# EasyEDA Pro project ProPrj_Segun O pcb_2026-03-03.epro, board KCP-2282-601-PCBV3.8
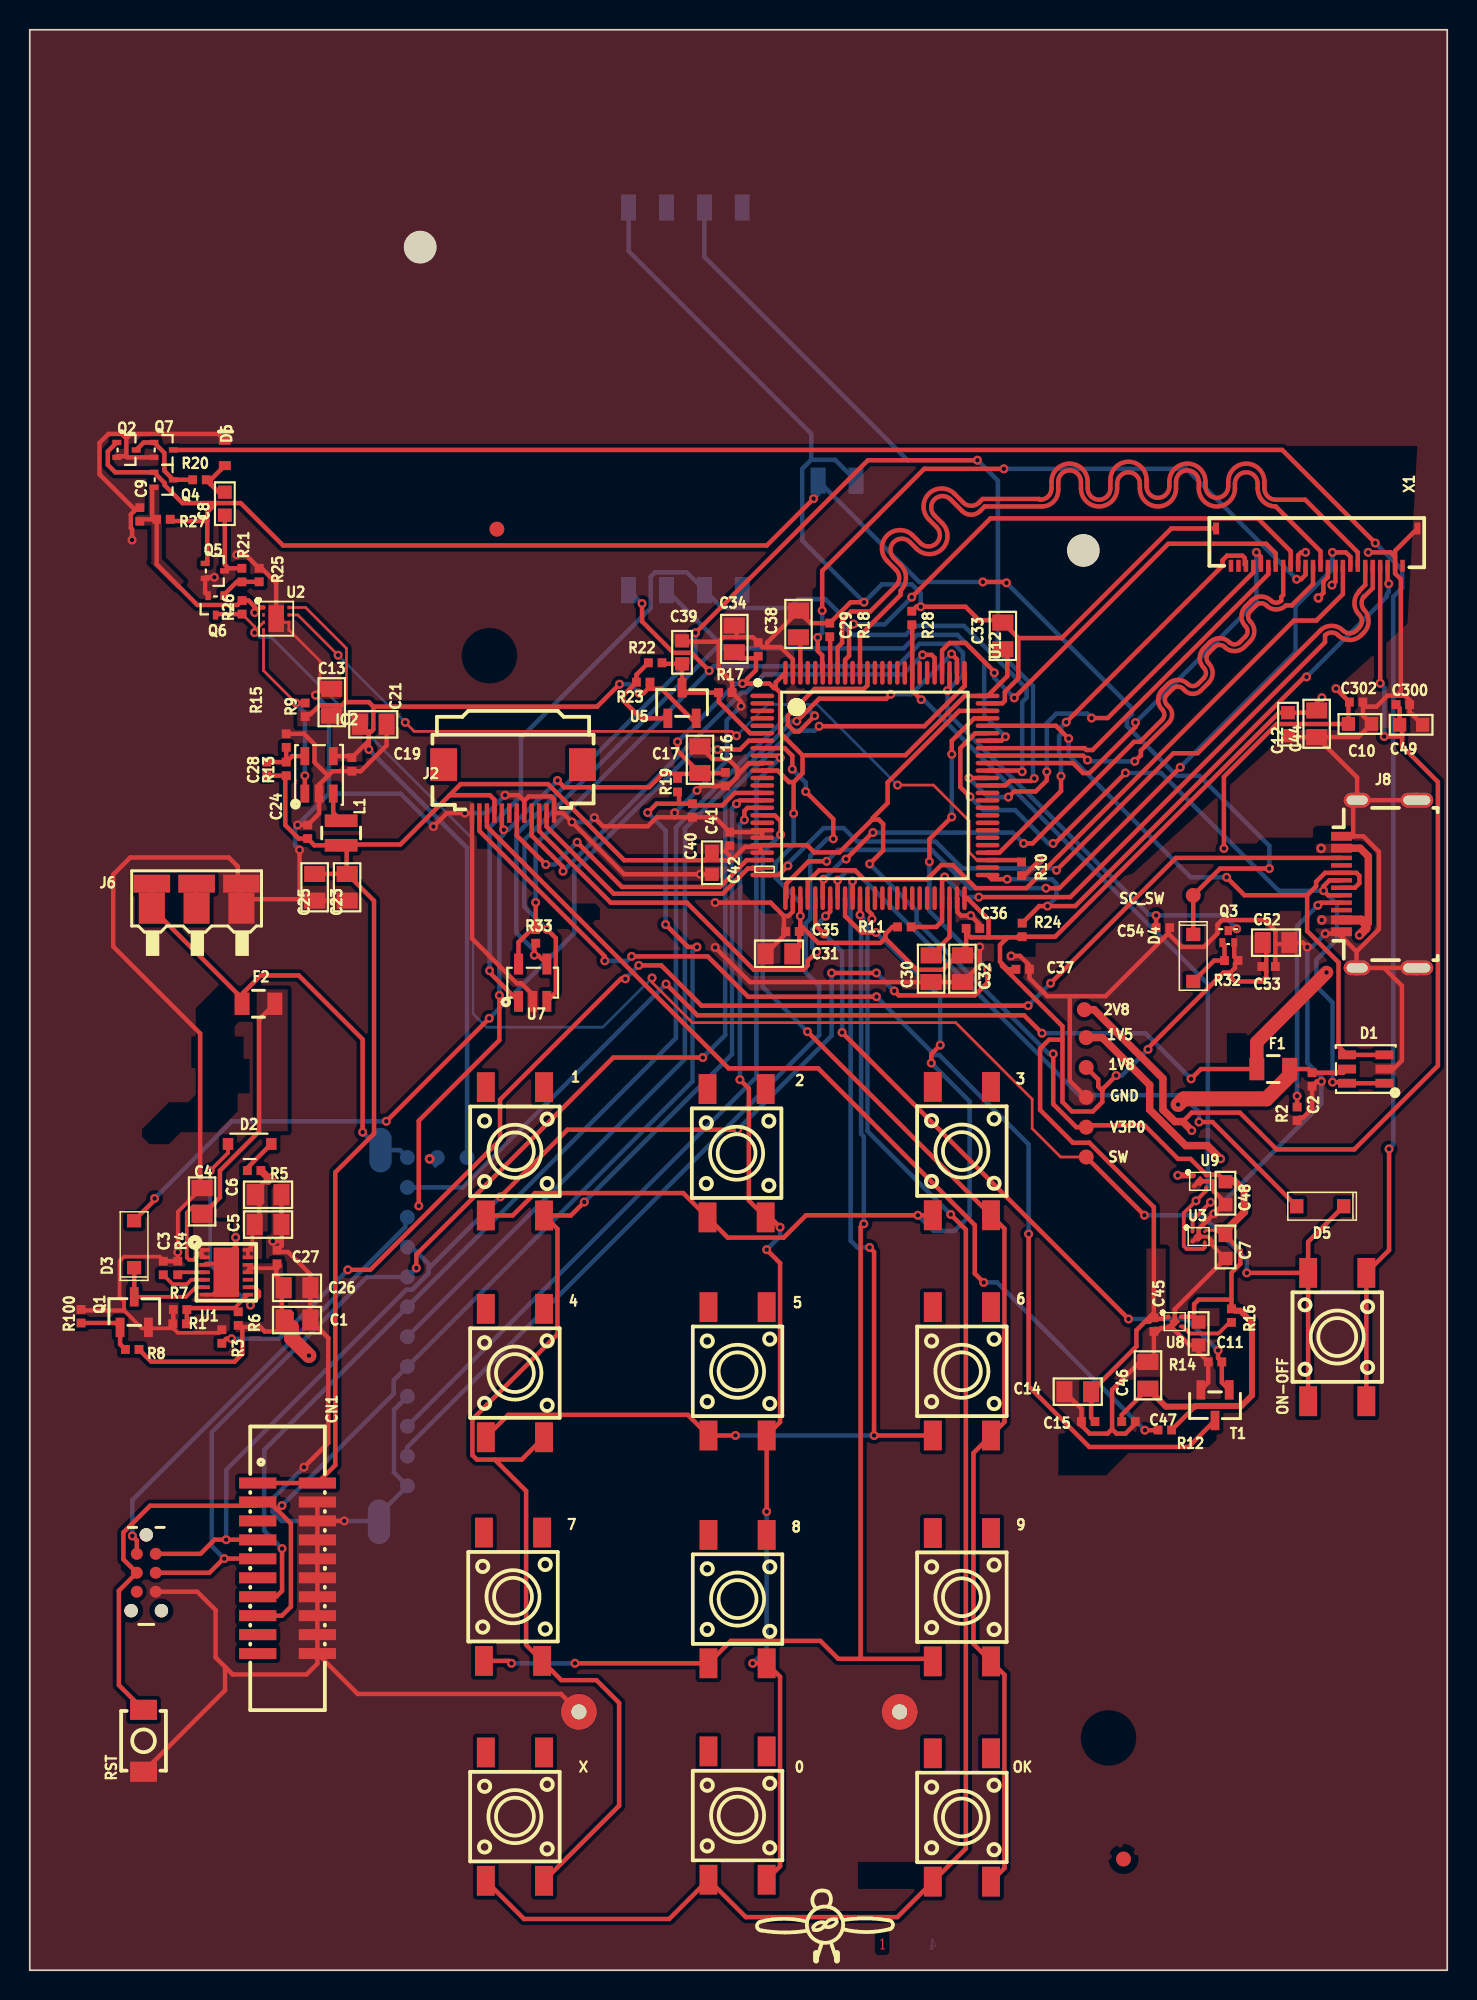
[diagram p4: board, top side]
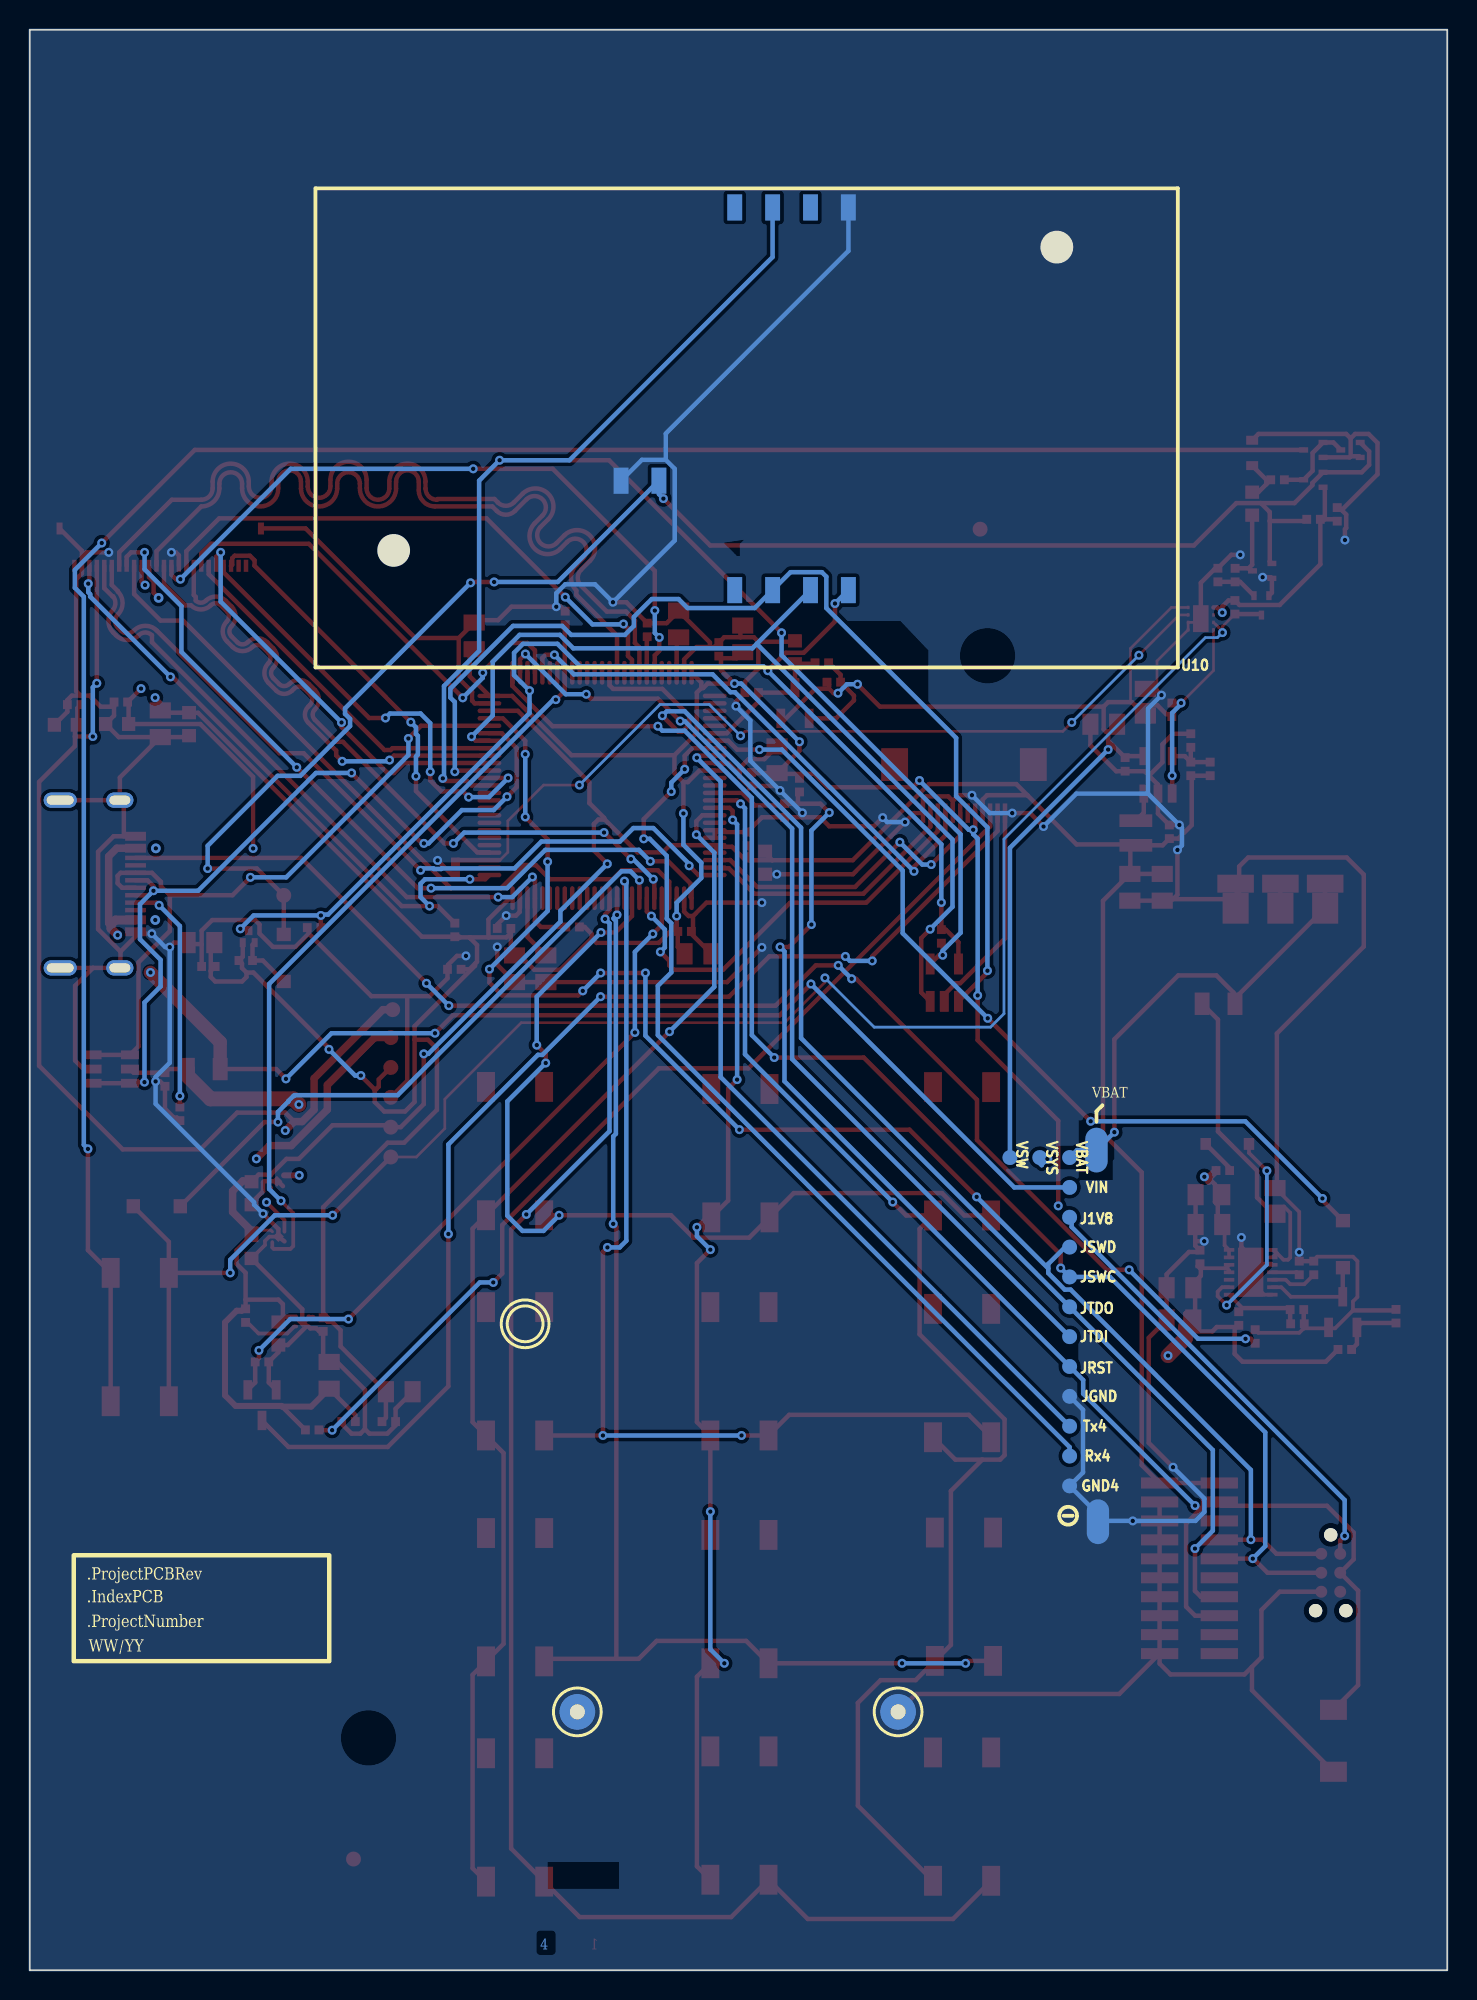
[diagram p5: board, bottom side, seen from below]

Outline 95 x 130 mm; copper layers: Top Layer, GND (2), VCC (3), Bottom Layer. Coordinates in mm from the lower left corner of the outline.
Outline path: 0,130 0,0 95,0 95,130 0,130
Stack: Top Layer 0.035mm / Dielectric1 0.127mm 2116 er 4.2 / GND (2) 0.035mm / Dielectric2 1.2mm FR-4 er 4.2 / VCC (3) 0.0356mm / Dielectric4 0.127mm 2116 er 4.2 / Bottom Layer 0.035mm

## Design rules (mm)
net CAM_D5: DP7
net CAM_PCLK: DP2
net CAM_XCLK: DP2
net CAM_D0: DP8
net CAM_D1: DP8
net CAM_D7: DP6
net CAM_RST: DP4
net CAM_D4: DP7
net CAM_VS: DP6
net CAM_SCL: DP4
template: User Custom Config
spacing Clearance_DEGRAP_1: track to track 0.152, other pairs 0.152 to 0.3
spacing BoardOutlineClearance_Overlay: track to track 0.125, other pairs 0.125 to 0.3
spacing BoardOutlineClearance_DEGRAPP: track to track 0.125, other pairs 0.125 to 0.3
spacing BoardOutlineClearance_HOLE_BLE_ANT: track to track 0.125, other pairs 0.125 to 0.3
spacing Clearance_RF: track to track 0.185, other pairs 0.185 to 0.3
spacing Clearance: track to track 0.125, other pairs 0.125 to 0.3
spacing Clearance_DEGRAP: track to track 0.5, other pairs 0.3 to 0.5
spacing BoardOutlineClearance: track to track 0.125, other pairs 0.125 to 0.3
spacing safeClearance (default): track to track 0.125, other pairs 0.125 to 0.3
track width Width (default): min 0.15, default 0.3, max 5
differential pair DiffPairsRouting (default): width min 0.15, default 0.15, max 0.15; gap min 0.15, default 0.15
differential pair DiffPairsRouting_100: width min 0.15, default 0.15, max 0.15; gap min 0.2, default 0.2
via RoutingVias (default): diameter min 0.25, default 0.6, max 10; hole min 0.1, default 0.3, max 8
net BLE_OUT uses Clearance_RF
net BLE_RF uses Clearance_RF
net BLE_ANT uses Clearance_RF

## Placement (name value [footprint] x y rotation side)
0  TS-1095PS-A1B2-C3D2  [KEY-SMD_4P-L6.0-W6.0-P3.90-LS9.0]  47.44 10.36 270 top
1  TS-1095PS-A1B2-C3D2  [KEY-SMD_4P-L6.0-W6.0-P3.90-LS9.0]  32.51 54.86 270 top
1V5  TP  [TESTPOINT 1MM]  70.81 62.48 180 top
1V8  TP  [TESTPOINT 1MM]  70.81 60.48 180 top
2  TS-1095PS-A1B2-C3D2  [KEY-SMD_4P-L6.0-W6.0-P3.90-LS9.0]  47.37 54.74 270 top
2V8  TP  [TESTPOINT 1MM]  70.68 64.35 180 top
3  TS-1095PS-A1B2-C3D2  [KEY-SMD_4P-L6.0-W6.0-P3.90-LS9.0]  62.47 54.88 270 top
4  TS-1095PS-A1B2-C3D2  [KEY-SMD_4P-L6.0-W6.0-P3.90-LS9.0]  32.51 40 270 top
5  TS-1095PS-A1B2-C3D2  [KEY-SMD_4P-L6.0-W6.0-P3.90-LS9.0]  47.44 40.12 270 top
6  TS-1095PS-A1B2-C3D2  [KEY-SMD_4P-L6.0-W6.0-P3.90-LS9.0]  62.47 40.12 270 top
7  TS-1095PS-A1B2-C3D2  [KEY-SMD_4P-L6.0-W6.0-P3.90-LS9.0]  32.39 25.02 270 top
8  TS-1095PS-A1B2-C3D2  [KEY-SMD_4P-L6.0-W6.0-P3.90-LS9.0]  47.44 24.86 270 top
9  TS-1095PS-A1B2-C3D2  [KEY-SMD_4P-L6.0-W6.0-P3.90-LS9.0]  62.47 24.99 270 top
B  TP  [PLAGE - ROUGE]  23.51 54.94 90 bottom
C1  4.7uF  [0805 - CAPACITOR]  17.91 43.56 0 top
C2  100nF  [0402 - CAPACITOR]  85.94 59.67 270 top
C3  4.7uF  [0402 - CAPACITOR]  8.94 47.05 270 top
C4  4.7uF  [0805 - CAPACITOR]  11.54 51.5 90 top
C5  4.7uF  [0805 - CAPACITOR]  15.97 49.96 0 top
C6  4.7uF  [0805 - CAPACITOR]  15.97 51.96 0 top
C7  1uF  [0603 - CAPACITOR]  80.14 48.45 270 top
C8  1uF  [0603 - CAPACITOR]  13.07 98.25 270 top
C9  100nF  [0402 - CAPACITOR]  7.37 97.54 90 top
C10  1uF  [0603 - CAPACITOR]  89.15 83.49 0 top
C11  1uF  [0603 - CAPACITOR]  78.34 42.65 270 top
C12  1uF  [0603 - CAPACITOR]  84.33 83.48 270 top
C13  4.7uF  [0805 - CAPACITOR]  20.23 84.95 90 top
C14  4.7uF  [0805 - CAPACITOR]  70.24 38.75 180 top
C15  100nF  [0402 - CAPACITOR]  70.94 36.75 180 top
C16  100nF  [0402 - CAPACITOR]  46.62 79.79 270 top
C17  4.7uF  [0805 - CAPACITOR]  44.91 81.09 90 top
C19  100nF  [0402 - CAPACITOR]  21.58 80.78 270 top
C21  4.7uF  [0805 - CAPACITOR]  23.02 83.48 0 top
C23  4.7uF  [0805 - CAPACITOR]  21.27 72.55 270 top
C24  100nF  [0402 - CAPACITOR]  18.62 76.27 90 top
C25  4.7uF  [0805 - CAPACITOR]  19.1 72.55 270 top
C26  4.7uF  [0805 - CAPACITOR]  17.91 45.72 0 top
C27  100nF  [0402 - CAPACITOR]  16.57 47.78 90 top
C28  9pF  [0402 - CAPACITOR]  15.88 80.48 270 top
C29  2.2uF  [0805 - CAPACITOR]  51.52 90.19 90 top
C30  2.2uF  [0805 - CAPACITOR]  60.41 67.09 270 top
C31  4.7uF  [0805 - CAPACITOR]  50.22 68.09 180 top
C32  4.7uF  [0805 - CAPACITOR]  62.52 67.09 270 top
C33  4.7uF  [0805 - CAPACITOR]  65.22 89.39 90 top
C34  4.7uF  [0805 - CAPACITOR]  47.22 89.19 90 top
C35  100nF  [0402 - CAPACITOR]  51.12 69.59 180 top
C36  100nF  [0402 - CAPACITOR]  63.22 69.79 0 top
C37  100nF  [0402 - CAPACITOR]  66.55 67.06 0 top
C38  100nF  [0402 - CAPACITOR]  48.81 88.49 90 top
C39  1uF  [0603 - CAPACITOR]  43.72 88.29 90 top
C40  100nF  [0402 - CAPACITOR]  44.41 77.69 270 top
C41  1uF  [0603 - CAPACITOR]  45.72 74.19 270 top
C42  100nF  [0402 - CAPACITOR]  46.91 75.79 90 top
C44  4.7uF  [0805 - CAPACITOR]  86.26 83.51 270 top
C45  100nF  [0402 - CAPACITOR]  75.34 43.25 270 top
C46  4.7uF  [0805 - CAPACITOR]  74.94 39.85 90 top
C47  100nF  [0402 - CAPACITOR]  73.64 36.75 0 top
C48  1uF  [0603 - CAPACITOR]  80.14 52.05 270 top
C49  0603X105K500CT  [0603 - CAPACITOR]  92.59 83.44 0 top
C52  4.7uF  [0805 - CAPACITOR]  83.53 68.85 0 top
C53  100nF  [0402 - CAPACITOR]  83.03 67.25 0 top
C54  100nF  [0402 - CAPACITOR]  75.95 69.85 0 top
C300  100nF  [0402 - CAPACITOR]  92.03 84.79 0 top
C302  0402B104K500CT  [0402 - CAPACITOR]  88.9 84.96 0 top
CN1  HX JN1.27-2x10 TP H4.9  [CONN-SMD_HX-JN1.27-2X10-TP-H4.9]  17.27 26.92 270 top
D1  82400152  [SOT23-6 0.95 VAR AA]  89.54 60.37 90 top
D2  LR_Y8SF-U1V2-1  [OSRAM LRY8SFU1V21]  14.73 55.24 270 top
D3  MBR0530  [SOD123 DIODE INC]  6.99 48.64 270 top
D4  MBR0530T1G  [SOD123 DIODE INC]  77.98 67.82 90 top
D5  MBR0530T1G  [SOD123 DIODE INC]  86.49 51.18 0 top
D6  BZX585-C3V0,115  [SOD523 TOSHIBA]  13.07 101.65 270 top
F1  BNP05000F000  [0805 - FUSE]  83.34 60.37 0 top
F2  0ZCK0075FF2E  [0805 - FUSE]  15.32 64.75 0 top
GND  TP  [TESTPOINT 1MM]  70.81 58.48 180 top
GND4  TP  [TESTPOINT 1MM]  25.31 32.44 270 bottom
IC2  SY8088IAAC  [SOT23-5 0.95 VAR AA]  19.38 80.08 0 top
J1V8  TP  [TESTPOINT 1MM]  25.31 50.44 270 bottom
J2  FFC2B35-12-G  [GCT FFC2B35-12-G]  32.39 80.77 180 top
J6  1982633-1  [TE 19826331]  11.18 71.75 180 top
J8  U6252-35c  [ANTENK U6252-35C]  92.97 72.77 270 top
JGND  TP  [TESTPOINT 1MM]  25.31 38.44 270 bottom
JRST  TP  [TESTPOINT 1MM]  25.31 40.44 270 bottom
JSWC  TP  [TESTPOINT 1MM]  25.31 46.44 270 bottom
JSWD  TP  [TESTPOINT 1MM]  25.31 48.44 270 bottom
JTDI  TP  [TESTPOINT 1MM]  25.31 42.44 270 bottom
JTDO  TP  [TESTPOINT 1MM]  25.31 44.44 270 bottom
L1  2.2uH  [CHILISON BWF00252012]  20.87 76.19 270 top
M  TP  [PLAGE - NOIRE]  23.41 30.04 270 bottom
Mire Top 1  DNI  [MIRE]  73.31 7.44 90 top
Mire Top 2  DNI  [MIRE]  31.31 96.54 90 top
NOREF  -  [Pad_ie1681]  30.81 88.06 0 top
NOREF#2  -  [Pad_ie1682]  72.3 15.56 0 top
NOREF#3  -  [Pad_ie1678]  58.3 17.3 0 top
NOREF#4  -  [Pad_ie1679]  36.8 17.3 0 top
OK  TS-1095PS-A1B2-C3D2  [KEY-SMD_4P-L6.0-W6.0-P3.90-LS9.0]  62.47 10.23 270 top
ON-OFF  TS-1095PS-A1B2-C3D2  [KEY-SMD_4P-L6.0-W6.0-P3.90-LS9.0]  87.63 42.42 90 top
P210  -  [TC2030-MCP-NL]  7.8 29.16 270 top
Q1  BSS123-TP  [SOT23-VAR AB]  7 44.09 0 top
Q2  RE1C001UNTCL  [SOT-416-3]  6.48 101.85 270 top
Q3  RZM002P02T2L  [SOT-723]  80.33 69.25 0 top
Q4  RE1C001ZPTL  [SOT-416-3]  8.97 99.85 270 top
Q5  RE1C001UNTCL  [SOT-416-3]  12.4 93.75 270 top
Q6  RE1C001ZPTL  [SOT-416-3]  12.45 91.44 180 top
Q7  RE1C001ZPTL  [SOT-416-3]  8.97 101.85 270 top
R1  ERTJ0EP473GM  [0402 - RESISTOR]  10.03 43.31 0 top
R2  5.1kΩ  [0402 - RESISTOR]  84.94 57.37 90 top
R3  5.1kΩ  [0402 - RESISTOR]  12.87 42.46 270 top
R4  5.1kΩ  [0402 - RESISTOR]  9.92 47.05 90 top
R5  200Ω  [0402 - RESISTOR]  15.03 53.57 180 top
R6  40.2kΩ  [0402 - RESISTOR]  13.97 43.66 270 top
R7  118kΩ  [0402 - RESISTOR]  10.07 44.26 0 top
R8  10kΩ  [0402 - RESISTOR]  6.86 41.59 0 top
R9  100kΩ  [0402 - RESISTOR]  18.45 84.44 90 top
R10  100kΩ  [0402 - RESISTOR]  66.47 73.79 90 top
R11  10kΩ  [0402 - RESISTOR]  58.62 69.89 180 top
R12  RC0402FR-0710RL  [0402 - RESISTOR]  76.07 36.19 0 top
R13  205kΩ  [0402 - RESISTOR]  17.18 80.48 90 top
R14  100kΩ  [0402 - RESISTOR]  79.44 40.75 0 top
R15  49.9kΩ  [0402 - RESISTOR]  17.18 82.38 270 top
R16  100kΩ  [0402 - RESISTOR]  80.54 43.85 270 top
R17  10kΩ  [0402 - RESISTOR]  46.62 85.59 180 top
R18  10kΩ  [0402 - RESISTOR]  53.62 89.79 270 top
R19  10kΩ  [0402 - RESISTOR]  43.41 79.39 90 top
R20  10kΩ  [0402 - RESISTOR]  11.37 99.85 0 top
R21  220kΩ  [0402 - RESISTOR]  14.21 93.47 90 top
R22  220kΩ  [0402 - RESISTOR]  41.91 87.59 180 top
R23  75kΩ  [0402 - RESISTOR]  41.12 86.29 0 top
R24  10kΩ  [0402 - RESISTOR]  66.52 69.69 270 top
R25  220kΩ  [0402 - RESISTOR]  15.37 93.47 270 top
R26  750kΩ  [0402 - RESISTOR]  14.23 91.31 90 top
R27  1MΩ  [0402 - RESISTOR]  8.95 97.21 180 top
R28  100kΩ  [0402 - RESISTOR]  59.12 90.59 270 top
R32  220kΩ  [0402 - RESISTOR]  80.53 67.65 180 top
R33  11.5kΩ  [0402 - RESISTOR]  33.9 69.26 90 top
R100  220kΩ  [0402 - RESISTOR]  3.43 43.81 270 top
RST  TS-1071AS-A1B3-D4  [SW-SMD_L4.0-W3.0-LS4.8]  7.62 15.37 90 top
Rx4  TP  [TESTPOINT 1MM]  25.31 34.44 0 bottom
SC_SW  TP  [TESTPOINT 1MM]  77.98 72.01 90 top
SW  TP  [TESTPOINT 1MM]  70.81 54.48 180 top
T1  NTR3C21NZT1G  [SOT23-VAR AB]  79.44 37.85 180 top
Tx4  TP  [TESTPOINT 1MM]  25.31 36.44 0 bottom
U1  MP2607DL-LF-P  [QFN14-0.5-3S4]  13.17 46.76 270 top
U2  XC6194AA05ER-G  [TOREX USP-8B06]  16.51 90.55 270 top
U3  NCP115AMX150TCG  [ON SEMI NCV8160AMX330TBG]  78.34 49.15 0 top
U5  TLVH431AQDBZRG4  [SOT23-VAR AB]  43.72 84.89 0 top
U7  ESDS312DBVR  [SOT95P270X145-5N]  33.7 66.16 90 top
U8  NCP115AMX180TCG  [ON SEMI NCV8160AMX330TBG]  76.74 43.45 0 top
U9  NCP115AMX280TCG  [ON SEMI NCV8160AMX330TBG]  78.44 52.85 0 top
U10  5145300-3  [SD-SMD_5145300-3]  47.75 105.28 0 bottom
U12  STM32H573VIT6  [LQFP-100_L14.0-W14.0-P0.50-LS16.0-BL]  56.64 79.37 270 top
V3P0  TP  [TESTPOINT 1MM]  70.81 56.48 270 top
VBAT  TP  [TESTPOINT 1MM]  25.31 54.44 270 bottom
VIN  TP  [TESTPOINT 1MM]  25.31 52.44 0 bottom
VSW  TP  [TESTPOINT 1MM]  29.31 54.44 0 bottom
VSYS  TP  [TESTPOINT 1MM]  27.31 54.44 270 bottom
X  TS-1095PS-A1B2-C3D2  [KEY-SMD_4P-L6.0-W6.0-P3.90-LS9.0]  32.51 10.29 270 top
X1  HC-FPC-05-09-24RLTAG  [HCTL HC-FPC-05-09-24RLTAG]  86.26 94.09 180 top

## Footprints (pads in the part's own frame, mm; a bottom-side part is the same pattern mirrored in y, then rotated)
0402 - CAPACITOR
  rect 0.59x0.6 smd: 1(-0.455,0) 2(0.455,0)
0402 - RESISTOR
  rect 0.59x0.6 smd: 1(-0.455,0) 2(0.455,0)
0603 - CAPACITOR
  rect 0.89x0.93 smd: 1(-0.77,0) 2(0.77,0)
0805 - CAPACITOR
  rect 1.08x1.42 smd: 1(-0.895,0) 2(0.895,0)
0805 - FUSE
  rect 1x1.5 smd: 1(-1.1,0) 2(1.1,0)
ANTENK U6252-35C
  rect 0.6x1.4 smd: A1_B12(3.2,-5.05) A4_B9(2.4,-5.05) B1_A12(-3.2,-5.05) B4_A9(-2.4,-5.05)
  rect 0.3x1.4 smd: A5(1.25,-5.05) A6(0.25,-5.05) A7(-0.25,-5.05) A8(-1.25,-5.05) B5(-1.75,-5.05) B6(-0.75,-5.05) B7(0.75,-5.05) B8(1.75,-5.05)
  oval 1x2.2 hole 0.6x1.8: S1(5.62,0) S4(-5.62,0)
  oval 1x1.8 hole 0.6x1.4: S2(-5.62,-4) S3(5.62,-4)
CHILISON BWF00252012
  rect 0.85x2.2 smd: 1(-0.825,0) 2(0.825,0)
CONN-SMD_HX-JN1.27-2X10-TP-H4.9
  rect 0.74x2.5 smd: 1(-5.715,-2) 2(-5.715,2) 3(-4.445,-2) 4(-4.445,2) 5(-3.175,-2) 6(-3.175,2) 7(-1.905,-2) 8(-1.905,2) 9(-0.635,-2) 10(-0.635,2) 11(0.635,-2) 12(0.635,2) 13(1.905,-2) 14(1.905,2) 15(3.175,-2) 16(3.175,2) 17(4.445,-2) 18(4.445,2) 19(5.715,-2) 20(5.715,2)
GCT FFC2B35-12-G
  rect 0.3x1.3 smd: 1(-2.75,3.25) 2(-2.25,3.25) 3(-1.75,3.25) 4(-1.25,3.25) 5(-0.75,3.25) 6(-0.25,3.25) 7(0.25,3.25) 8(0.75,3.25) 9(1.25,3.25) 10(1.75,3.25) 11(2.25,3.25) 12(2.75,3.25)
  rect 1.8x2.2 smd: S1(-4.65,0) S2(4.65,0)
HCTL HC-FPC-05-09-24RLTAG
  rect 0.4x0.8 smd: 0(-6.75,-2.5) 0(6.75,-2.5)
  rect 0.3x0.8 smd: 1(-5.75,0) 2(-5.25,0) 3(-4.75,0) 4(-4.25,0) 5(-3.75,0) 6(-3.25,0) 7(-2.75,0) 8(-2.25,0) 9(-1.75,0) 10(-1.25,0) 11(-0.75,0) 12(-0.25,0) 13(0.25,0) 14(0.75,0) 15(1.25,0) 16(1.75,0) 17(2.25,0) 18(2.75,0) 19(3.25,0) 20(3.75,0) 21(4.25,0) 22(4.75,0) 23(5.25,0) 24(5.75,0)
KEY-SMD_4P-L6.0-W6.0-P3.90-LS9.0
  rect 2x1.2 smd: 1(-4.3,1.95) 2(4.3,1.95) 3(-4.3,-1.95) 4(4.3,-1.95)
LQFP-100_L14.0-W14.0-P0.50-LS16.0-BL
  oval 0.3x1.6 smd: 1(-6,-7.55) 2(-5.5,-7.55) 3(-5,-7.55) 4(-4.5,-7.55) 5(-4,-7.55) 6(-3.5,-7.55) 7(-3,-7.55) 8(-2.5,-7.55) 9(-2,-7.55) 10(-1.5,-7.55) 11(-1,-7.55) 12(-0.5,-7.55) 13(0,-7.55) 14(0.5,-7.55) 15(1,-7.55) 16(1.5,-7.55) 17(2,-7.55) 18(2.5,-7.55) 19(3,-7.55) 20(3.5,-7.55) 21(4,-7.55) 22(4.5,-7.55) 23(5,-7.55) 24(5.5,-7.55) 25(6,-7.55) 51(6,7.55) 52(5.5,7.55) 53(5,7.55) 54(4.5,7.55) 55(4,7.55) 56(3.5,7.55) 57(3,7.55) 58(2.5,7.55) 59(2,7.55) 60(1.5,7.55) 61(1,7.55) 62(0.5,7.55) 63(0,7.55) 64(-0.5,7.55) 65(-1,7.55) 66(-1.5,7.55) 67(-2,7.55) 68(-2.5,7.55) 69(-3,7.55) 70(-3.5,7.55) 71(-4,7.55) 72(-4.5,7.55) 73(-5,7.55) 74(-5.5,7.55) 75(-6,7.55)
  oval 1.6x0.3 smd: 26(7.55,-6) 27(7.55,-5.5) 28(7.55,-5) 29(7.55,-4.5) 30(7.55,-4) 31(7.55,-3.5) 32(7.55,-3) 33(7.55,-2.5) 34(7.55,-2) 35(7.55,-1.5) 36(7.55,-1) 37(7.55,-0.5) 38(7.55,0) 39(7.55,0.5) 40(7.55,1) 41(7.55,1.5) 42(7.55,2) 43(7.55,2.5) 44(7.55,3) 45(7.55,3.5) 46(7.55,4) 47(7.55,4.5) 48(7.55,5) 49(7.55,5.5) 50(7.55,6) 76(-7.55,6) 77(-7.55,5.5) 78(-7.55,5) 79(-7.55,4.5) 80(-7.55,4) 81(-7.55,3.5) 82(-7.55,3) 83(-7.55,2.5) 84(-7.55,2) 85(-7.55,1.5) 86(-7.55,1) 87(-7.55,0.5) 88(-7.55,0) 89(-7.55,-0.5) 90(-7.55,-1) 91(-7.55,-1.5) 92(-7.55,-2) 93(-7.55,-2.5) 94(-7.55,-3) 95(-7.55,-3.5) 96(-7.55,-4) 97(-7.55,-4.5) 98(-7.55,-5) 99(-7.55,-5.5) 100(-7.55,-6)
MIRE
  round 1 smd: 0(0,0)
ON SEMI NCV8160AMX330TBG
  rect 0.1x0.1 smd: 1(-0.405,0.325) 2(-0.405,-0.325) 3(0.405,-0.325) 4(0.405,0.325)
  rect 0.52x0.52 smd rot 45: 5(0,0)
OSRAM LRY8SFU1V21
  rect 0.8x0.7 smd: 1(-0.112,-1.45) 2(-0.112,1.45)
Pad_ie1678
  round 2.4 hole 1: 0(0,0)
Pad_ie1679
  round 2.4 hole 1: 0(0,0)
Pad_ie1681
  round 0.003 hole 3.2: 2(0,0)
Pad_ie1682
  round 0.003 hole 3.2: 2(0,0)
PLAGE - NOIRE
  rrect 3x1.5 smd: 1(0,0)
PLAGE - ROUGE
  rrect 3x1.5 smd: 1(0,0)
QFN14-0.5-3S4
  rect 0.25x0.7 smd: 1(-1.5,-1.45) 2(-1,-1.45) 3(-0.5,-1.45) 4(0,-1.45) 5(0.5,-1.45) 6(1,-1.45) 7(1.5,-1.45) 8(1.5,1.45) 9(1,1.45) 10(0.5,1.45) 11(0,1.45) 12(-0.5,1.45) 13(-1,1.45) 14(-1.5,1.45)
  rect 3.3x1.7 smd: TH_PAD(0,0)
SD-SMD_5145300-3
  rect 1x1.75 smd: C1(-7.62,12.82) C2(-5.08,12.82) C3(-2.54,12.82) C4(0,12.82) C5(-7.62,-12.82) C6(-5.08,-12.82) C7(-2.54,-12.82) C8(0,-12.82) C9(5.08,5.49) C10(7.62,5.49)
SOD123 DIODE INC
  rect 0.9x0.95 smd: A(-1.575,0) C(1.575,0)
SOD523 TOSHIBA
  rect 0.6x0.8 smd: A(-0.85,0) C(0.85,0)
SOT23-5 0.95 VAR AA
  rect 0.59x1.21 smd: 1(-0.95,-1.255) 2(0,-1.255) 3(0.95,-1.255) 4(0.95,1.255) 5(-0.95,1.255)
SOT23-6 0.95 VAR AA
  rect 0.59x1.21 smd: 1(-0.95,-1.255) 2(0,-1.255) 3(0.95,-1.255) 4(0.95,1.255) 5(0,1.255) 6(-0.95,1.255)
SOT23-VAR AB
  rect 0.59x1.3 smd: 1(-0.95,-1.025) 2(0.95,-1.025) 3(0,1.025)
SOT95P270X145-5N
  rect 1.4x0.6 smd: 1(-1.25,0.95) 2(-1.25,0) 3(-1.25,-0.95) 4(1.25,-0.95) 5(1.25,0.95)
SOT-416-3
  rect 0.36x0.6 smd: 1(-0.5,-0.65) 2(0.5,-0.65) 3(0,0.65)
SOT-723
  rect 0.4x0.6 smd: 1(-0.4,-0.4) 2(0.4,-0.4)
  rect 0.5x0.6 smd: 3(0,0.4)
SW-SMD_L4.0-W3.0-LS4.8
  rect 1.35x1.8 smd: 1(-2.075,0) 2(2.075,0)
TC2030-MCP-NL
  round 0.8 smd: 1(1.27,-0.635) 2(1.27,0.635) 3(2.54,-0.635) 4(2.54,0.635) 5(3.81,-0.635) 6(3.81,0.635)
  round 0.9 hole 0.889: A(0,0) B(5.08,1.016) C(5.08,-1.016)
TE 19826331
  rect 1.75x2.08 smd: 1(-3,0.6) 2(0,0.6) 3(3,0.6)
  rect 2.45x1.2 smd: 4(-3,-1.04) 5(0,-1.04) 6(3,-1.04)
TESTPOINT 1MM
  round 1 smd: 1(0,0)
TOREX USP-8B06
  rect 0.23x0.18 smd: 1(-0.75,-0.85) 2(-0.25,-0.85) 3(0.25,-0.85) 4(0.75,-0.85) 5(0.75,0.85) 6(0.25,0.85) 7(-0.25,0.85) 8(-0.75,0.85)
  rrect 1.8x1.04 smd: TH_PAD(0,0)

## Nets
GND: C1.2 C2.2 C3.1 C4.2 C5.2 C6.2 C7.2 C9.2 C10.2 C11.2 C12.2 C13.2 C14.2 C15.2 C16.2 C17.2 C19.2 C21.2 C23.2 C24.2 C25.2 C26.2 C27.2 C29.2 C30.2 C31.2 C32.2 C33.2 C34.2 C35.2 C36.2 C37.2 C38.2 C39.2 C40.2 C41.2 C42.2 C44.2 C45.2 C46.2 C47.2 C48.2 C49.2 C52.2 C53.2 C54.2 C300.2 C302.2 CN1.4 CN1.6 CN1.8 CN1.10 CN1.12 CN1.14 CN1.16 CN1.18 CN1.20 D1.2 D6.A GND.1 GND4.1 IC2.2 J2.1 J2.5 J2.12 J6.1 J6.4 J8.A1_B12 J8.B1_A12 J8.S1 J8.S2 J8.S3 J8.S4 JGND.1 M.1 NOREF#3.0 NOREF#4.0 P210.6 Q1.2 Q2.2 Q5.2 Q6.2 Q7.2 R1.1 R2.1 R3.1 R4.2 R7.1 R10.1 R14.1 R15.1 R17.1 R18.1 R25.1 R28.1 R100.1 RST.1 T1.2 U1.3 U1.7 U1.TH_PAD U2.5 U2.6 U2.TH_PAD U3.2 U3.5 U7.2 U8.2 U8.5 U9.2 U9.5 U10.C5 U10.C10 U12.10 U12.19 U12.20 U12.27 U12.49 U12.74 U12.99 X1.0 X1.2 X1.15
V1P5: 1V5.1 C10.1 C302.1 U3.1 X1.10
V1P8: 1V8.1 C12.1 C14.1 C15.1 C16.1 C17.1 C31.1 C32.1 C33.1 C34.1 C35.1 C36.1 C37.1 C38.1 C44.1 C45.1 C52.1 C53.1 J1V8.1 J2.8 P210.1 Q3.2 R11.2 R19.2 R24.2 R32.1 U8.1 U12.11 U12.28 U12.50 U12.75 U12.100 X1.11
V2P8: 2V8.1 C49.1 C300.1 U9.1 X1.4
V3P0: C7.1 C11.1 C23.1 C24.1 C25.1 C28.2 C41.1 C42.1 C46.1 C47.1 C48.1 CN1.1 CN1.2 J2.9 L1.2 R12.2 R13.1 R16.1 U3.4 U8.4 U9.4 U12.21 U12.22 U12.73 V3P0.1
VBAT: C39.1 R17.2 R22.1 U5.3 U12.6
BAT: C4.1 F2.2 U1.1 U1.2
BAT_BSI: J6.2 J6.5
BL_A: J2.10 R12.1
BL_K: J2.11 T1.3
CAM_D0: U12.68 X1.19
CAM_D1: U12.64 X1.21
CAM_D2: U12.54 X1.22
CAM_D3: U12.66 X1.20
CAM_D4: U12.79 X1.18
CAM_D5: U12.92 X1.16
CAM_D6: U12.95 X1.14
CAM_D7: U12.90 X1.12
CAM_HS: U12.29 X1.9
CAM_PCLK: U12.31 X1.17
CAM_PD: U12.26 X1.8
CAM_RST: U12.25 X1.6
CAM_SCL: R11.1 U12.47 X1.5
CAM_SDA: R24.1 U12.51 X1.3
CAM_VS: U12.93 X1.7
CAM_XCLK: U12.67 X1.13
CC1: J8.A5 R2.2
CC2: J8.B5 R3.2
JTCK_SWCLK: CN1.9 JSWC.1 P210.4 U12.76
JTDI: JTDI.1 U12.77
JTDO_SWO: CN1.13 JTDO.1 U12.89
JTMS_SWDIO: CN1.7 JSWD.1 P210.2 U12.72
KBD_C0: 3.2 6.2 9.2 OK.2 U12.17
KBD_C1: 0.2 2.2 5.2 8.2 U12.16
KBD_C2: 1.2 4.2 7.2 U12.15 X.2
KBD_R0: 0.4 OK.4 U12.37 X.4
KBD_R1: 7.4 8.4 9.4 U12.36
KBD_R2: 4.4 5.4 6.4 U12.35
KBD_R3: 1.4 2.4 3.4 U12.34
MCU_BOOT0: R18.2 U12.94
MCU_OSC_IN: U12.12
MCU_OSC_OUT: U12.13
MCU_SC_PRES: C54.1 Q3.3 R33.2 U7.5 U10.C1 U12.78
MCU_USB2_N: D1.1 D1.6 J8.A7 J8.B7 U12.70
MCU_USB2_P: D1.3 D1.4 J8.A6 J8.B6 U12.71
PWR_CAM_EN: R28.2 U3.3 U9.3 U12.83
PWR_HALT_REQ: D5.A U12.33
PWR_KILL: R10.2 U2.7 U12.53
RS_RST: U7.3 U10.C2 U12.69
SC_PRES_SW: D4.C Q2.1 Q4.1 Q5.1 R27.1 SC_SW.1 U10.C9
SC_UART_CLK: U7.1 U10.C3 U12.65
SC_UART_TX: R33.1 U7.4 U10.C7 U12.63
SCR_BL_PWM: R14.2 T1.1 U12.30
SCR_D/C: J2.6 U12.23
SCR_RST: J2.2 U12.24
SCR_SPI_MOSI: J2.3 U12.32
SCR_SPI_SCK: J2.4 U12.80
SCR_TE: J2.7
SYS_PG: IC2.1 R9.2 U2.4
USB_5V: F1.1 J8.A4_B9 J8.B4_A9 VIN.1
VSYS: C5.1 C6.1 C9.1 Q4.2 R5.1 R26.2 R27.2 U1.13 U1.14 U2.1 VSYS.1
VSYS_SWITCHED: C13.1 C19.1 C21.1 IC2.4 R9.1 R23.2 U2.8 U5.2 VSW.1
VUSB: C1.1 C2.1 C26.1 C27.1 D1.5 F1.2 R6.2 R8.2 U1.11 U1.12
VUSB_OK: D3.A U12.7
~CEB~: D3.C Q1.3 U1.6
$1N16: R4.1 U1.4
$1N17: C3.2 U1.5
$1N19: Q1.1 R8.1 R100.2
$1N22: R1.2 R6.1 R7.2 U1.8
$1N24: D2.2 R5.2
$1N29: B.1 F2.1 J6.3 J6.6 VBAT.1
$1N33: Q6.1 R21.1 R25.2
$1N36: ON-OFF.3 ON-OFF.4 Q7.3
$1N37: D5.C ON-OFF.1 ON-OFF.2 Q6.3 R26.1 SW.1 U2.3
$1N39: C8.2 Q5.3 R21.2
$1N41: Q2.3 Q4.3 Q7.1 R20.1
$1N44: R16.2 U8.3
$1N61: IC2.3 L1.1
$1N62: C28.1 IC2.5 R13.2 R15.2
$1N76: C8.1 D6.C R20.2
$1N2048: D2.1 U1.9
$2N6611: Rx4.1 U12.8
$2N6613: Tx4.1 U12.9
$2N6996: C40.1 CN1.3 CN1.15 JRST.1 P210.3 R19.1 RST.2 U12.14
$2N8175: R22.2 R23.1 U5.1
$2N8230: C30.1 U12.48
$2N8280: C29.1 U12.98
$3N22: D4.A Q3.1 R32.2

Pads without a net: 0 1 3; 1 1 3; 2 1 3; 3 1 3; 4 1 3; 5 1 3; 6 1 3; 7 1 3; 8 1 3; 9 1 3; CN1 5 11 17 19; J2 S1 S2; J8 A8 B8; Mire Top 1 0; Mire Top 2 0; NOREF 2; NOREF#2 2; OK 1 3; P210 5 A B C; U1 10; U2 2; U10 C4 C6 C8; U12 1 2 3 4 5 18 38 39 40 41 42 43 44 45 46 52 55 56 57 58 59 60 61 62 81 82 84 85 86 87 88 91 96 97; X 1 3; X1 1 23 24

## Via types
v1: diameter 0.6, hole 0.3, Top Layer to Bottom Layer, 226 vias
v2: diameter 0.65, hole 0.3, Top Layer to Bottom Layer, 4 vias

## Routing (per net, layer and track width the routed paths; a pad name or vN(x,y) marks a point on that pad's centre or on a via; arc(x,y) is an arc through that point)
GND: length 685.7
  Top Layer w0.1: 76.44,43.15 U8.2
  Top Layer w0.18: 19.45,85.73 19.45,87.71 U2.5 U2.6 16.76,90.3 U2.TH_PAD
  Top Layer w0.25: U1.7 12.27,45.26 13.17,46.16 U1.TH_PAD ; 8.11,43 7.52,43 6.31,44.2 6.31,44.8 6.02,45.1 6.02,47.5 6.31,47.8 8.72,47.8 9.02,47.5 ; 8.11,43 9.61,43 9.92,42.7 12.66,42.7 R3.1 ; 8.11,43 Q1.2 ; R4.2 v1(9.92,48.1) 9.92,50.8 11.42,52.3 C4.2 ; C7.2 79.24,48.58 79.24,48.85 78.95,49.14 78.35,49.14 U3.5 ; 13.28,47.34 11.8,47.34 U1.3
  Top Layer w0.3: 9.61,43 9.61,43.3 ; 9.61,43.3 R1.1 ; 9.61,43.3 9.61,44.26 ; R2.1 85.14,57.12 85.34,57.12 85.94,57.72 C2.2 86.27,59.55 v1(86.57,59.55) ; 91.59,85.39 91.9,85.69 91.9,93.19 91.51,93.58 X1.2 91.51,94.69 ; 91.59,85.39 91,85.39 90.26,84.65 89.36,84.65 ; 91.59,85.39 92.19,85.39 92.49,85.09 C300.2 92.49,84.31 C49.2 ; 66.25,89.25 65.06,90.45 63.62,90.45 62.72,91.35 v1(59.72,91.35) 59.41,91.35 R28.1 ; 66.25,89.25 69.17,89.25 76.51,96.59 X1.0 ; 66.25,89.25 66.25,86.55 65.35,85.65 65.35,85.05 65.18,84.87 U12.74 ; 18.38,71.75 19,71.75 C25.2 C23.2 ; 18.38,71.75 18.08,72.05 v1(18.08,75.05) ; 18.38,71.75 14.18,71.75 ; CN1.6 19.27,31.37 ; CN1.6 CN1.8 CN1.10 CN1.12 CN1.14 CN1.18 19.27,21.21 ; CN1.6 v1(21.07,30.1) ; 43.22,77.24 C40.2 45.93,77.24 C42.2 48.97,76.25 U12.19 U12.20 ; 43.22,77.24 v1(43.22,77.54) ; 43.22,77.24 42.02,77.24 41.42,76.64 38.42,76.64 v1(37.84,77.22) ; 50.54,70.62 50.84,70.62 51.14,70.92 U12.27 ; 50.54,70.62 50.54,69.71 C35.2 50.66,69.43 C31.2 ; 50.54,70.62 49.64,71.52 v1(45.93,71.52) ; 47.37,89.3 47.37,89.93 C34.2 ; 47.37,89.3 46.47,89.3 46.17,89 ; 47.37,89.3 48.46,89.3 C38.2 49.12,88.65 49.41,88.65 ; 91.51,94.69 91.51,95.09 X1.0 ; 91.51,94.69 91.21,94.99 v1(89.71,94.99) ; C44.2 88.97,79.9 J8.S2 ; C44.2 89.04,82.61 C10.2 89.36,84.05 89.36,84.65 ; C44.2 84.43,82.61 84.33,82.71 ; 79.97,51.28 v1(79.37,50.68) 78.34,49.65 U3.5 U3.2 ; 79.97,51.28 79.97,51.58 79.37,52.18 79.37,52.78 79.3,52.85 U9.5 ; 79.97,51.28 C48.2 ; C9.2 7.23,97.99 7.07,97.83 ; R15.1 18.37,82.84 19.08,82.13 19.08,80.93 19.98,80.03 ; 16.89,48.84 16.89,48.54 16.59,48.24 ; 16.89,48.84 v1(16.28,48.84) ; 16.89,48.84 16.89,49.94 C5.2 C6.2 ; v1(44.72,79.04) 45.02,79.34 C16.2 ; 76.31,69.46 72.1,65.26 69.71,65.26 ; 76.31,69.46 77.21,68.56 78.71,68.56 79.6,69.46 79.6,70.06 79.91,70.36 82.78,70.36 83.49,69.65 83.49,68.75 ; 76.31,69.46 76.31,69.75 C54.2 ; 33.14,78.34 J2.5 ; 33.14,78.34 32.75,78.72 v1(31.85,78.72) ; 33.14,78.34 33.44,78.64 34.94,78.64 35.14,78.44 J2.1 35.74,77.52 v1(36.34,76.92) 39.83,73.42 v1(44.93,73.42) C41.2 ; v1(85.51,94.99) 85.21,94.99 85.01,94.79 X1.15 ; v1(85.62,68.55) 85.32,68.85 C52.2 84.32,68.75 83.49,68.75 ; 51.52,91.05 52.31,90.25 R18.1 55.02,91.65 v1(55.91,91.65) ; 51.52,91.05 C29.2 ; 51.52,91.05 49.41,88.95 49.41,88.65 ; v1(67.67,74.35) 66.65,73.34 R10.1 ; 90.77,67.15 J8.S3 88.93,67.19 88.93,68.25 ; 90.77,67.15 J8.S1 ; 90.77,67.15 91.97,65.95 91.97,60.94 91.4,60.37 D1.2 ; v1(47.67,84.69) 47.67,84.99 R17.1 47.07,86.3 46.17,87.2 46.17,89 ; v1(63.67,68.55) 63.67,67.35 C32.2 C30.2 48.26,66.2 v1(45.93,68.52) ; 69.71,65.26 69.71,59.58 GND.1 ; 69.71,65.26 68.21,65.26 67,66.46 67,67.06 66.97,67.09 66.97,67.35 66.37,67.95 v1(65.77,67.95) ; 6.31,44.2 3.5,44.2 R100.1 ; 46.17,89 43.78,89 C39.2 ; 83.49,68.75 C53.2 ; v1(13.87,94.83) 14.47,94.83 R25.1 15.45,93.85 15.61,93.85 16.51,92.95 U2.TH_PAD ; 72.54,36.25 72.84,35.95 73.44,35.95 74.09,36.6 C47.2 ; 72.54,36.25 72.54,38.88 74.41,40.75 C46.2 75.34,41.15 C45.2 75.59,42.8 75.8,43 76.21,43 U8.2 ; 72.54,36.25 72.24,35.95 71.04,35.95 70.49,36.5 C15.2 70.49,37.61 C14.2 ; v1(19.15,85.43) 19.45,85.73 20.11,85.73 C13.2 ; C21.2 23.91,82.06 22.18,80.33 C19.2 20.28,80.33 19.98,80.03 ; 88.93,68.25 90.43,69.75 90.43,74.93 89.38,75.97 88.7,75.97 ; 88.93,68.25 87.72,69.45 ; 88.7,75.97 88.7,78.12 J8.S2 ; 88.7,75.97 J8.B1_A12 ; 16.59,48.24 C27.2 ; 16.59,48.24 16.7,48.12 17.3,48.12 18.8,46.62 C26.2 C1.2 20,42.36 20,35.33 v1(18.37,33.7) ; T1.2 78.99,39.37 R14.1 78.34,41.4 C11.2 77.71,41.88 76.44,43.15 U8.5 76.74,44.28 C7.2 ; U7.2 33.7,65.35 32.94,66.12 32.64,66.12 29.64,69.12 J2.12 v1(29.15,77.52) 27.95,77.52 v1(27.05,76.62) ; 13.09,20.31 13.08,20.31 13.08,18.75 RST.1 ; 13.09,20.31 13.59,19.81 18.54,19.81 19.27,20.54 19.27,21.21 ; 13.09,20.31 12.45,20.95 12.45,24.13 11.22,25.35 P210.6 ; 6.47,101.43 5.9,101.43 Q2.2 ; 6.47,101.43 6.47,102.63 ; 6.47,101.43 6.54,101.35 8.32,101.35 ; 49.41,88.65 50.31,88.65 51.14,87.82 51.14,86.92 ; 89.36,84.65 C302.2 ; 19.98,80.03 19.38,79.43 IC2.2 19.38,77.49 C24.2 v1(17.95,76.73) ; 13.94,72.56 13.94,72.29 14.18,72.05 14.18,71.75 ; 13.94,72.56 13.94,73.94 13.34,74.55 6.73,74.55 5.59,73.41 5.59,68.58 11.42,62.75 11.42,52.3 ; 13.94,72.56 14.18,72.79 ; v1(6.85,95.82) 6.85,96.54 6.77,96.63 6.77,97.53 7.07,97.83 ; 6.47,102.63 6.77,102.93 12.65,102.93 13.07,102.5 ; 6.47,102.63 6.17,102.93 5.27,102.93 4.67,102.33 4.67,100.23 7.07,97.83 ; 14.18,71.75 14.18,71.15 ; J8.S2 J8.S4 ; 19.27,21.21 21.98,18.5 35.6,18.5 NOREF#4.0 ; Q6.2 11.75,92.29 Q5.2 11.83,93.33 v1(12.37,93.33) ; U12.10 49.06,80.84 48.16,80.84 47.42,80.1 ; 47.42,80.1 47.42,80.54 46.82,81.14 45.77,81.14 C17.2 ; 47.42,80.1 47.42,79.94 46.82,79.34 46.52,79.34 ; v1(86.82,69.45) 87.72,69.45 ; 87.72,69.45 J8.A1_B12 ; C36.2 63.67,70.05 v1(63.07,70.65) 62.41,70.65 62.17,70.9 62.17,71.8 U12.49 ; v1(13.79,49.09) 13.79,48.45 13.28,47.94 13.28,46.87 U1.TH_PAD ; R4.2 C3.1 ; 78.36,52.85 78.03,52.53
  GND (2) w0.25: 15.39,48.84 15.88,48.35 15.88,44.69 15.09,43.9 14.11,43.9 v1(9.92,48.1)
  GND (2) w0.3: v1(13.79,49.09) 15.13,49.09 15.39,48.84 v1(16.28,48.84) ; v1(6.85,95.82) 9.34,93.33 v1(12.37,93.33) v1(13.87,94.83) ; v1(44.93,73.42) 44.93,72.82 45.93,71.82 v1(45.93,71.52) v1(45.93,68.52) ; v1(67.67,74.35) 67.8,74.48 69.17,74.48 69.47,74.18 69.47,71.65 v1(65.77,67.95) 64.27,67.95 v1(63.67,68.55) 63.67,70.05 v1(63.07,70.65) ; v1(89.71,94.99) 89.11,95.59 86.11,95.59 v1(85.51,94.99) ; NOREF#3.0 NOREF#4.0
  Bottom Layer w0.3: 20.05,78.83 v1(17.95,76.73) 17.78,76.55 17.78,75.35 v1(18.08,75.05) ; 20.05,78.83 20.05,84.53 v1(19.15,85.43) ; 20.05,78.83 24.85,78.83 v1(27.05,76.62) ; v1(31.85,78.72) 30.65,77.52 v1(29.15,77.52) ; v1(43.22,77.54) v1(44.72,79.04) 46.71,81.03 46.71,83.73 v1(47.67,84.69) ; U10.C10 53.98,101.19 52.37,101.19 ; U10.C5 40.13,115.19 52.37,102.95 52.37,101.19 ; v1(36.34,76.92) 37.54,76.92 v1(37.84,77.22) ; 52.37,101.19 51.77,100.59 51.77,95.79 v1(55.91,91.65) 57.12,92.85 59.12,92.85 59.72,92.25 v1(59.72,91.35) ; v1(79.37,50.68) 79.97,51.28 79.97,51.45 86.57,58.05 v1(86.57,59.55) 86.57,59.85 85.62,60.79 v1(85.62,68.55) 85.93,68.55 v1(86.82,69.45) ; v1(18.37,33.7) 16.27,31.6 16.27,30.7 16.87,30.1 v1(21.07,30.1) 23.35,30.1 M.1 23.41,30.54 GND4.1 24.41,33.34 24.41,37.54 JGND.1
V1P5: length 67.1
  Top Layer w0.254: v1(79.13,51.45) 77.94,50.25 77.94,49.48
  Top Layer w0.3: X1.10 87.51,93.03 v1(87.28,92.8) ; v1(80.03,75.15) 80.03,79.95 83.58,83.49 C10.1 88.38,84.89 88.45,84.96 v1(87.55,85.86)
  Top Layer w0.5: v1(79.82,54.36) 78.93,55.24 77.47,55.24 75.06,57.66 75.06,59.31 71.89,62.48 1V5.1
  VCC (3) w0.3: v1(87.55,85.86) 87.28,86.13 v1(87.28,92.8)
  VCC (3) w0.5: v1(79.13,51.45) 79.82,52.13 v1(79.82,54.36) 81.66,56.21 81.66,73.52 v1(80.03,75.15)
V1P8: length 268.8
  Top Layer w0.1: 75.04,43.44 75.24,43.64
  Top Layer w0.3: 48.07,86.2 49.57,86.2 49.87,85.9 49.99,85.9 ; 48.07,86.2 v1(47.77,86.2) ; 48.07,86.2 48.07,86.5 48.67,87.1 48.67,87.89 ; 75.27,43.64 C45.1 ; 75.27,43.64 75.95,43.64 76.03,43.76 76.29,43.76 76.31,43.78 ; 75.27,43.64 75.04,43.44 74.74,43.44 ; C31.1 51.57,68.55 C35.1 51.64,69.67 51.64,70.02 ; R24.2 66.47,69.19 66.17,69.19 ; R24.2 68.72,69.24 83.72,84.24 84.32,84.24 C12.1 86.1,84.25 C44.1 86.26,84.91 v1(86.6,85.26) ; R24.2 66.22,69.24 66.17,69.19 ; 57.34,69.15 57.34,69.12 59.44,67.02 61.19,67.02 62.39,68.22 ; 57.34,69.15 57.34,69.42 57.81,69.89 R11.2 ; 57.34,69.15 57.02,68.82 52.84,68.82 51.64,70.02 ; 43.31,80.15 42.41,80.15 41.51,79.25 35.83,79.25 v1(35.37,79.71) ; 43.31,80.15 43.31,79.95 R19.2 ; 43.31,80.15 44.87,80.15 C17.1 ; 49.99,85.9 49.99,86.27 50.64,86.92 ; 49.99,85.9 50.29,85.6 50.29,82.9 51.79,81.4 ; 65.54,69.19 66.17,69.19 ; 65.54,69.19 65.46,69.19 ; 65.54,69.19 65.46,69.12 ; 51.64,70.02 v1(51.64,70.62) U12.28 ; 82.88,66.95 82.88,68.75 C52.1 ; 82.88,66.95 C53.1 ; 82.88,66.95 82.88,66.54 82.57,66.24 80.78,66.24 80.48,66.54 80.48,66.84 ; C33.1 65.52,88.2 65.52,86.7 U12.75 62.67,85.37 58.69,81.4 51.79,81.4 ; 65.46,69.19 65.46,69.12 ; 65.46,69.19 64.26,69.19 ; P210.1 7.17,28.79 v1(6.87,29.09) ; v1(74.95,61.69) 74.95,61.77 80.02,66.84 80.48,66.84 ; 48.67,87.89 C38.1 ; 48.67,87.89 47.62,87.89 C34.1 ; 65.46,69.12 65.03,68.68 65.03,67.56 65.16,67.43 ; U12.11 50.12,80.37 50.89,79.6 51.19,79.6 ; 71.77,59.04 71.88,58.93 71.88,58.17 71.25,57.53 69.85,57.53 69.22,58.17 69.22,62.34 ; 71.77,59.04 71.91,59.04 v1(72.81,59.94) ; 71.77,59.04 71.62,59.2 71.62,59.67 1V8.1 ; 80.48,66.84 80.78,67.14 80.78,67.44 R32.1 80.73,67.9 Q3.2 ; 51.79,81.4 51.79,80.2 51.19,79.6 ; 74.74,43.44 75.34,44.04 75.34,51.11 71.02,55.44 69.91,55.44 67.72,57.64 67.72,61.74 68.31,62.34 69.22,62.34 ; 74.74,43.44 74.17,42.87 74.17,41.79 C14.1 71.13,37.01 C15.1 ; 62.39,68.22 C32.1 ; 62.39,68.22 62.76,68.59 62.76,69.49 ; v1(43.41,82.3) 43.41,81.7 C17.1 ; v1(31.47,65.31) 31.47,62.31 26.07,56.91 v1(26.07,51.21) ; 51.19,79.6 v1(51.19,77.5) ; 65.16,67.43 65.16,67.29 69.22,63.24 69.22,62.34 ; 65.16,67.43 65.53,67.06 C37.1 ; C17.1 46.56,80.2 C16.1 ; 62.76,69.49 C36.1 ; 62.76,69.49 63.06,69.19 64.26,69.19 ; 64.26,69.19 64.26,70.39 62.83,71.82 U12.50 ; v2(86.37,91.94) 86.7,92.27 86.7,93.04 87.01,93.34 X1.11 ; v1(31.77,76.41) 31.64,76.54 J2.8
  VCC (3) w0.3: v2(86.37,91.94) 86.78,91.52 86.78,87.55 86.6,87.37 v1(86.6,85.26)
  Bottom Layer w0.3: v1(51.19,77.5) 51.19,75.4 49.99,74.2 49.99,73.17 51.64,71.52 v1(51.64,70.62) ; v1(43.41,82.3) 47.31,86.2 v1(47.77,86.2) ; v1(74.95,61.69) 73.2,59.94 v1(72.81,59.94) ; v1(31.47,65.31) 31.47,75.81 31.77,76.11 v1(31.77,76.41) 32.07,76.41 v1(35.37,79.71) ; v1(6.87,29.09) 6.87,31.5 25.17,49.79 25.17,50.31 J1V8.1
V2P8: length 75
  Top Layer w0.3: 77.28,56.85 77.88,57.45 81.1,57.45 83.57,54.99 88.78,54.99 94.38,60.59 94.38,79.61 91.98,82.01 91.98,82.65 ; 91.98,82.65 91.98,83.27 C49.1 91.81,84.55 C300.1 ; 91.98,82.65 v1(90.78,82.65) ; v1(90.51,86.22) X1.4
  Top Layer w0.4: v1(76.94,53.25) 77.96,53.25
  Top Layer w0.5: 2V8.1 71.34,64.35 75.95,59.74 75.95,57.65 76.75,56.85 77.28,56.85 v1(77.88,56.25)
  VCC (3) w0.5: v1(76.94,53.25) 77.88,54.19 v1(77.88,56.25)
  Bottom Layer w0.3: v1(90.51,86.22) 90.78,85.95 v1(90.78,82.65)
V3P0: length 195.2
  Top Layer w0.1: C48.1 80.04,52.88
  Top Layer w0.2: 79.75,49.58 78.84,49.58 78.75,49.48
  Top Layer w0.3: C23.1 23.07,71.65 23.07,56.05 20.47,53.45 20.47,33.84 CN1.2 CN1.1 ; C23.1 21.24,73.48 21.24,75.42 ; C23.1 C25.1 ; 48.98,75.26 47.94,75.26 47.04,74.36 46.77,74.36 ; 48.98,75.26 U12.21 52.09,75.37 52.58,74.89 54.27,74.89 56.46,77.09 56.51,77.09 ; 48.98,75.26 48.98,74.98 U12.22 ; 46.77,74.36 46.91,74.51 46.91,74.66 46.62,74.96 C42.1 ; 46.77,74.36 45.24,74.36 ; 45.24,74.36 45.54,74.66 C41.1 ; 45.24,74.36 39.84,74.36 34.74,79.46 28.88,79.46 28.14,78.72 ; J2.9 31.14,78.42 30.84,78.72 28.14,78.72 ; 80.54,44.92 78.34,44.92 78.04,44.62 78.04,43.72 ; 80.54,44.92 80.54,44.31 ; 80.54,44.92 80.54,46.72 81.14,47.32 81.14,48.22 C7.1 ; 56.51,77.09 56.51,77.21 57.49,78.19 57.49,79.57 62.29,84.37 U12.73 ; 56.51,77.09 56.9,77.09 57.19,76.79 57.19,75.02 v1(56.29,74.12) ; 28.14,78.72 24.84,75.42 21.24,75.42 ; C48.1 79.66,53.31 78.87,53.31 78.84,53.28 78.84,53.31 77.79,54.36 76.96,54.36 74.71,56.61 70.93,56.61 V3P0.1 70.14,56.48 68.59,58.03 v1(68.59,61.39) ; C28.2 R13.1 17.12,79.97 17.12,76.72 18.02,75.82 C24.1 19.07,75.36 L1.2 20.92,75.42 21.24,75.42 ; 78.04,43.72 77.98,43.78 77.17,43.78 ; 78.04,43.72 C11.1 ; 78.09,37.76 R12.2 ; C47.1 73.19,37.2 C46.1
  Top Layer w0.4: 80.54,44.31 80.67,44.31 80.79,44.18 81.14,44.18 81.92,43.4 81.92,38.51 81.21,37.8 78.14,37.8 78.09,37.76 76.14,37.76 C46.1
  Top Layer w0.5: 80.04,52.88 80.73,52.88 81.41,52.2 81.41,50.8 80.19,49.58 79.78,49.58 C7.1
  Bottom Layer w0.3: v1(68.59,61.39) 68.29,61.39 59.44,70.25 59.44,70.98 v1(56.29,74.12)
VBAT: length 10
  Top Layer w0.3: R22.1 42.44,87.52 C39.1 U5.3 44.04,85.59 R17.2 46.18,85.57 46.18,84.97 48.28,82.87 U12.6
BAT: length 22.9
  Top Layer w0.25: 11.42,48.05 U1.2 ; 11.42,48.05 U1.1 ; 11.42,48.05 10.97,47.6 10.67,47.6 10.52,47.75 10.52,50.75 10.94,51.17 12.14,51.17
  Top Layer w0.3: C4.1 11.84,50.87 12.74,51.77 12.74,53.57 15.36,56.19 15.36,63.69 F2.2
BAT_BSI: length 1.6
  Top Layer w0.3: 11.18,71.15 11.18,72.79
BL_A: length 64.5
  Top Layer w0.3: J2.10 30.64,76.62 46.84,60.42 52.84,60.42 63.34,49.92 63.34,46.68 v1(63.94,46.08) ; v1(74.74,36.18) 75.6,36.18 R12.1
  Bottom Layer w0.3: v1(74.74,36.18) 64.84,46.08 v1(63.94,46.08)
BL_K: length 78.2
  Top Layer w0.3: v1(38.54,67.62) 38.54,67.92 30.14,76.32 J2.11 ; T1.3 77.66,35.05 71.02,35.05 66.95,39.12 v1(66.95,49.32) ; v1(40.34,67.92) 45.44,67.92 48.14,65.22 v1(56.75,65.22)
  Bottom Layer w0.3: v1(56.75,65.22) 60.65,61.32 60.95,61.32 66.95,55.32 v1(66.95,49.32) ; v1(40.34,67.92) 40.04,67.62 v1(38.54,67.62)
CAM_D0: length 24.3
  Top Layer w0.3: X1.19 83.01,93.53 71.23,81.75 70.82,81.75 70.69,81.87 U12.68
CAM_D1: length 30
  Top Layer w0.3: v1(71.16,83.89) 72.25,83.89 82.01,93.65 X1.21 ; v1(62.94,79.87) U12.64 ; v1(65.59,78.59) 65.97,78.97 67.42,78.97 68.16,79.72 v1(68.16,80.29)
  Bottom Layer w0.3: v1(62.94,79.87) 64.22,78.59 v1(65.59,78.59) ; v1(71.16,83.89) 70.86,84.19 68.81,84.19 68.16,83.55 v1(68.16,80.29)
CAM_D2: length 28.9
  Top Layer w0.3: v1(69.12,79.99) 69.12,79 65.01,74.89 64.21,74.89 U12.54 ; v1(69.46,83.62) 79.94,94.09 79.94,94.46 80.25,94.77 81.27,94.77 81.44,94.61 81.44,94.17 X1.22
  Bottom Layer w0.3: v1(69.46,83.62) 69.12,83.27 69.12,82.82 68.99,82.7 68.99,81.44 69.12,81.32 v1(69.12,79.99)
CAM_D3: length 27.6
  Top Layer w0.3: U12.66 69.93,80.87 70.6,80.21 71.02,80.21 74.11,83.29 v1(74.11,83.59) ; X1.20 82.51,94.69 v1(82.21,94.99)
  Bottom Layer w0.3: v1(74.11,83.59) 82.21,91.69 v1(82.21,94.99)
CAM_D4: length 31.2
  Top Layer w0.3: v1(64.64,86.92) 64.64,87 62.72,88.92 61.64,88.92 61.14,88.42 61.14,86.92 ; X1.18 83.51,94.93 82.87,95.57 76.31,95.57 v1(65.98,85.25)
  Bottom Layer w0.3: v1(64.64,86.92) 64.64,86.59 v1(65.98,85.25)
CAM_D5: length 37.6
  Top Layer w0.3: v1(59.11,91.99) 64.39,97.27 82.31,97.27 84.51,95.07 X1.16 ; 54.64,86.92 54.64,87.79 54.91,88.06 54.91,89.89 v1(55.21,90.19)
  Bottom Layer w0.3: v1(55.21,90.19) 55.24,90.17 57.29,90.17 v1(59.11,91.99)
CAM_D6: length 46.1
  Top Layer w0.3: 53.14,86.92 53.11,86.96 53.11,88.09 52.81,88.39 v1(52.81,89.29) ; v1(84.91,93.19) 85.21,93.19 85.51,93.49 X1.14 ; v1(53.11,91.09) 53.11,93.75 59.95,100.59 v1(65.28,100.59)
  Bottom Layer w0.3: v1(65.28,100.59) 77.51,100.59 v1(84.91,93.19) ; v1(52.81,89.29) 53.11,89.59 v1(53.11,91.09)
CAM_D7: length 58.9
  Top Layer w0.3: 55.64,86.92 55.64,89.42 58.37,92.15 58.37,92.43 arc(58.72,93.29) 58.37,94.15 57.91,94.61 arc(57.91,95.69) 58.98,95.69 59.45,95.22 arc(61.16,95.22) 61.16,96.94 60.63,97.46 arc(60.64,98.54) 61.71,98.54 62.49,97.76 arc(63.09,97.51) 63.7,97.76 64,98.07 67.84,98.07 arc(68.61,98.39) 68.93,99.15 68.93,99.72 arc(69.69,100.49) 70.45,99.72 70.45,99.28 arc(71.67,98.07) 72.88,99.28 72.88,99.6 arc(73.64,100.36) 74.4,99.6 74.4,99.28 arc(75.61,98.07) 76.83,99.28 76.83,99.72 arc(77.59,100.49) 78.35,99.72 78.35,99.28 arc(79.56,98.07) 80.77,99.28 80.77,99.6 arc(81.54,100.36) 82.3,99.6 82.3,99.28 arc(82.65,98.42) 83.51,98.07 86.51,95.07 X1.12
CAM_HS: length 48.6
  Top Layer w0.3: X1.9 88.01,92.2 86.24,90.42 84.73,90.42 66.8,72.49 63.41,72.49 61.86,74.04 61.09,74.04 60.14,73.09 55.91,73.09 55.31,73.69 52.91,73.69 52.14,72.93 U12.29
CAM_PCLK: length 47.5
  Top Layer w0.3: v1(56.51,76.22) 56.49,76.22 v1(54.71,74.44) ; 79.09,88.97 78.69,88.57 ; 76.29,86.17 75.9,85.78 arc(75.63,85.12) 75.9,84.46 arc(76.04,84.12) 75.9,83.78 74.42,82.3 74.01,82.3 67.21,75.49 v1(66.61,75.49) ; X1.17 84.01,92.14 83.88,92 83.88,91.76 arc(83.54,91.62) 83.2,91.76 arc(82.54,92.03) 81.88,91.76 81.48,91.36 arc(81.21,90.7) 81.48,90.04 arc(81.62,89.7) 81.48,89.36 81.09,88.97 arc(80.75,88.83) 80.4,88.97 arc(79.74,89.24) 79.09,88.97 ; v1(53.21,73.09) 53.14,73.02 U12.31 ; 78.69,88.57 arc(78.42,87.91) 78.69,87.25 arc(78.83,86.91) 78.69,86.57 78.3,86.18 arc(77.95,86.03) 77.61,86.18 arc(76.95,86.45) 76.29,86.18
  Bottom Layer w0.3: v1(54.71,74.44) 54.56,74.44 v1(53.21,73.09) ; v1(66.61,75.49) 65.88,76.22 v1(56.51,76.22)
CAM_PD: length 53.3
  Top Layer w0.3: v1(87.31,94.99) 88.21,94.99 88.51,94.69 X1.8 ; v1(68.11,72.49) 69.01,72.49 v1(77.11,80.59) ; U12.26 50.71,71.89 50.71,72.79 52.21,74.29 v1(53.41,74.29)
  Bottom Layer w0.3: v1(87.31,94.99) 87.31,93.86 84.84,91.39 84.84,88.32 v1(77.11,80.59) ; v1(53.41,74.29) 54.17,75.06 60.45,75.06 63.01,72.49 v1(68.11,72.49)
CAM_RST: length 54.2
  Top Layer w0.3: v1(50.81,73.99) 50.19,73.37 U12.25 ; v1(68.81,73.69) 76.65,81.53 78.27,81.53 86.5,89.76 arc(87.26,90.07) 88.02,89.76 arc(88.47,89.57) 88.91,89.76 89.1,89.94 ; X1.6 89.51,92.81 89.1,92.4 89.1,92.36 arc(88.78,91.6) 89.1,90.83 arc(89.28,90.39) 89.1,89.94
  Bottom Layer w0.3: v1(50.81,73.99) 50.81,74.12 53.21,76.52 54.55,76.52 55.45,75.62 60.71,75.62 62.51,73.82 67.39,73.82 67.43,73.78 67.91,73.78 67.95,73.82 68.68,73.82 v1(68.81,73.69)
CAM_SCL: length 46.8
  Top Layer w0.3: X1.5 90.01,92.59 89.46,92.04 89.42,92.04 arc(89.27,91.6) 89.42,91.15 arc(89.73,90.39) 89.42,89.63 89.23,89.44 arc(88.47,89.12) 87.7,89.44 arc(87.26,89.62) 86.81,89.44 86.81,88.97 69.74,71.89 v1(63.61,71.89) ; v1(61.31,73.24) 61.14,73.07 U12.47 61.14,70.29 60.75,69.89 R11.1
  Bottom Layer w0.3: v1(61.31,73.24) 62.67,71.89 v1(63.61,71.89)
CAM_SDA: length 42.3
  Top Layer w0.3: X1.3 91.01,92.97 v1(91.09,92.89) ; R24.1 67.66,71.29 v1(68.21,71.29) 70.07,71.29 85.43,86.65 v1(85.57,86.65) ; v1(65.51,73.09) 64.48,73.09 U12.51
  Bottom Layer w0.3: v1(65.51,73.09) 68.51,73.09 68.81,72.79 68.81,71.89 v1(68.21,71.29) ; v1(85.57,86.65) 90.96,92.03 90.96,92.19 91.09,92.32 v1(91.09,92.89)
CAM_VS: length 63.9
  Top Layer w0.3: X1.7 89.01,94.99 85.49,98.52 83.51,98.52 arc(82.97,98.74) 82.75,99.28 82.75,99.72 arc(81.54,100.94) 80.32,99.72 80.32,99.41 arc(79.56,98.64) 78.8,99.41 78.8,99.72 arc(77.59,100.94) 76.38,99.72 76.38,99.41 arc(75.61,98.64) 74.85,99.41 74.85,99.85 arc(73.64,101.06) 72.43,99.85 72.43,99.28 arc(71.67,98.52) 70.9,99.28 70.9,99.72 arc(69.69,100.94) 68.48,99.72 68.48,99.28 arc(68.26,98.74) 67.72,98.52 67.67,98.57 63.86,98.57 63.63,98.34 63.63,98.33 arc(63.09,98.11) 62.56,98.33 61.97,98.92 arc(60.25,98.92) 60.25,97.21 60.78,96.68 arc(60.78,95.61) 59.7,95.61 59.18,96.13 arc(57.46,96.13) 57.46,94.42 58.05,93.83 arc(58.27,93.29) 58.05,92.75 56.33,91.03 55.04,91.03 54.44,90.43 54.44,88.93 54.14,88.63 54.14,86.92
CAM_XCLK: length 33.3
  Top Layer w0.3: v1(74.06,80.99) 74.47,81.4 74.47,81.71 76.34,83.59 arc(76.56,84.12) 76.34,84.65 76.22,84.78 arc(76.08,85.12) 76.22,85.46 76.61,85.86 arc(76.95,86) 77.29,85.86 77.42,85.73 arc(77.95,85.51) 78.49,85.73 79.01,86.25 arc(79.28,86.91) 79.01,87.57 arc(78.87,87.91) 79.01,88.25 79.4,88.65 arc(79.75,88.79) 80.09,88.65 arc(80.75,88.38) 81.41,88.65 81.8,89.04 arc(82.07,89.7) 81.8,90.36 arc(81.66,90.7) 81.8,91.05 82.19,91.44 arc(82.54,91.58) 82.88,91.44 arc(83.54,91.17) 84.2,91.44 84.59,91.44 86.01,92.87 X1.13 ; U12.67 70.59,81.37 v1(70.89,81.07)
  Bottom Layer w0.3: v1(74.06,80.99) 70.97,80.99 v1(70.89,81.07)
CC1: length 15.7
  Top Layer w0.3: v1(84.94,58.57) R2.2 ; J8.A5 86.51,71.52 v1(86.34,71.35)
  Bottom Layer w0.3: v1(86.34,71.35) 84.94,69.96 v1(84.94,58.57)
CC2: length 92.3
  Top Layer w0.3: v1(40.82,67.32) 42.32,67.32 45.02,64.62 v1(66.92,64.62) ; v1(68.42,66.12) 76.82,74.52 J8.B5 ; v1(13.52,42.3) 13.17,42.3 R3.2 ; v1(21.32,46.92) 22.82,46.92 31.52,55.62 31.52,58.32 39.62,66.42 v1(39.92,66.42)
  Bottom Layer w0.3: v1(13.52,42.3) 16.7,42.3 v1(21.32,46.92) ; v1(68.42,66.12) v1(66.92,64.62) ; v1(40.82,67.32) v1(39.92,66.42)
JTCK_SWCLK: length 98
  Top Layer w0.3: v1(45.11,61.14) 39.11,61.14 25.91,47.94 v1(25.91,47.04) ; v1(52.91,83.34) 59.96,83.34 62.66,86.04 62.66,86.9 62.64,86.92 ; CN1.9 15.26,27.57 v1(13.03,27.57) 12.98,27.57 12.04,26.62 P210.4
  Bottom Layer w0.3: v1(13.03,27.57) 12.19,28.41 12.19,36.03 22.61,46.44 JSWC.1 v1(25.91,47.04) ; v1(45.11,61.14) 46.61,62.64 46.61,78.54 51.11,83.04 52.61,83.04 v1(52.91,83.34)
JTDI: length 65.9
  Top Layer w0.3: v1(61.78,88.19) 62.14,87.82 62.14,86.92 ; v1(57.71,85.49) 57.41,85.19 52.91,85.19 v1(51.41,83.69)
  Bottom Layer w0.3: v1(57.71,85.49) 59.08,85.49 v1(61.78,88.19) ; v1(51.41,83.69) 51.11,83.69 43.91,76.49 43.91,61.04 JTDI.1
JTDO_SWO: length 87.6
  Top Layer w0.3: v1(52.61,84.04) 51.55,82.98 51.27,82.98 50.81,83.44 50.81,84.04 52.61,85.84 55.91,85.84 56.14,86.08 56.14,86.92 ; CN1.13 16.51,25.02 16.91,25.41 v1(16.91,28.25)
  Bottom Layer w0.3: v1(52.61,84.04) 52.31,84.34 51.11,84.34 43.31,76.54 43.31,62.44 JTDO.1 15.71,34.84 15.71,29.44 v1(16.91,28.25)
JTMS_SWDIO: length 104
  Top Layer w0.3: v1(61.79,77.27) 60.29,75.77 v1(60.29,74.27) ; v1(57.94,65.61) 58.24,65.31 63.34,65.31 64.19,66.17 v1(64.19,67.07) ; U12.72 64.19,83.87 63.29,83.87 61.79,82.37 v1(61.79,81.47) ; P210.2 11.44,27.89 12.39,28.84 v1(13.16,28.84) 15.26,28.84 CN1.7 ; v1(31.54,51.81) 36.04,56.31 v1(47.44,56.31) ; v1(53.74,66.81) v1(56.74,66.81)
  Bottom Layer w0.3: 26.74,47.01 v1(31.54,51.81) ; 26.74,47.01 26.74,47.31 25.61,48.44 JSWD.1 ; 26.74,47.01 26.74,46.71 25.63,45.59 25.24,45.59 13.16,33.51 v1(13.16,28.84) ; v1(47.44,56.31) 53.74,62.61 v1(53.74,66.81) ; v1(64.19,67.07) 60.29,70.97 v1(60.29,74.27) ; v1(61.79,77.27) v1(61.79,81.47) ; v1(56.74,66.81) v1(57.94,65.61)
KBD_C0: length 81.7
  Top Layer w0.3: U12.17 49.93,77.37 50.32,76.98 v1(50.32,76.08) ; v1(52.12,62.88) 3.2 65.32,49.68 65.32,36.72 6.2 63.25,34.65 63.25,21.86 9.2 65.32,19.79 65.32,6.83 OK.2
  Bottom Layer w0.3: v1(50.32,76.08) 49.12,74.88 49.12,65.88 v1(52.12,62.88)
KBD_C1: length 77.5
  Top Layer w0.3: 0.2 50.29,6.96 50.29,19.66 8.2 v1(48.45,20.56) ; v1(47.59,59.67) 48.19,59.07 48.19,51.57 49.32,50.44 49.62,50.44 v1(50.29,49.77) ; v1(49.39,48.27) 50.29,47.37 50.29,36.72 5.2 v1(49.39,30.72) ; U12.16 48.1,77.87 47.89,77.67 v1(47.89,77.07)
  Bottom Layer w0.3: v1(49.39,30.72) 49.39,21.5 v1(48.45,20.56) ; v1(47.89,77.07) 47.59,76.77 v1(47.59,59.67) ; v1(49.39,48.27) 50.29,49.17 v1(50.29,49.77)
KBD_C2: length 95.3
  Top Layer w0.3: 31.16,34.2 29.96,34.2 29.66,34.5 29.66,36.91 35.36,42.6 35.36,49.66 1.2 36.26,50.56 v1(37.16,51.46) ; 31.16,34.2 33.26,32.1 33.26,21.79 7.2 35.62,19.43 37.97,19.43 39.5,17.91 39.5,11.02 X.2 ; 31.16,34.2 32.96,34.2 4.2 ; v1(47.36,78.14) 47.59,78.37 U12.15
  Bottom Layer w0.3: v1(47.36,78.14) 47.06,77.84 47.06,61.36 v1(37.16,51.46)
KBD_R0: length 103.9
  Top Layer w0.3: U12.37 56.14,71.03 56.44,70.73 v1(56.44,70.43) ; v1(61.72,50.63) 62.74,49.62 62.74,8.15 OK.4 58.15,3.56 47.99,3.56 45.49,6.06 42.86,3.43 33.12,3.43 X.4
  Bottom Layer w0.3: v1(56.44,70.43) 56.14,70.13 56.14,56.21 v1(61.72,50.63)
KBD_R1: length 82.6
  Top Layer w0.3: v1(55.9,50) 55.69,49.79 55.69,20.86 ; 9.4 60.35,20.86 55.69,20.86 ; v1(36.54,20.56) 45.49,20.56 46.99,22.06 52.99,22.06 54.19,20.86 55.69,20.86 ; v1(55.64,70.7) U12.36 ; v1(32.28,20.56) 32.12,20.72 7.4
  Bottom Layer w0.3: v1(55.64,70.7) 55.87,70.48 55.87,70.46 55.72,70.31 55.72,56.03 55.9,55.86 v1(55.9,50) ; v1(32.28,20.56) v1(36.54,20.56)
KBD_R2: length 70.6
  Top Layer w0.3: v1(56.29,48.42) 56.59,48.12 v1(56.59,35.82) 6.4 ; v1(47.3,35.82) 45.49,35.82 44.1,37.2 32.06,37.2 4.4 ; v1(55.14,72.97) U12.35
  Bottom Layer w0.3: v1(47.3,35.82) v1(56.59,35.82) ; v1(55.14,72.97) 55.02,72.84 55.02,48.87 55.47,48.42 v1(56.29,48.42)
KBD_R3: length 62.6
  Top Layer w0.3: 3.4 v1(59.52,50.58) 52.02,50.58 50.52,49.08 46.78,49.08 2.4 43.8,52.06 33.86,52.06 32.36,50.56 1.4 ; U12.34 54.64,70.62 55.75,69.52 v1(56.72,69.52) ; v1(60.42,60.78) 60.42,61.38 v1(61.02,61.98)
  Bottom Layer w0.3: v1(61.02,61.98) 61.02,65.22 v1(56.72,69.52) ; v1(60.42,60.78) 62.99,58.21 62.99,50.55 61.98,49.53 60.57,49.53 v1(59.52,50.58)
MCU_BOOT0: length 2.4
  Top Layer w0.3: R18.2 53.64,89.31 53.64,86.92
MCU_SC_PRES: length 84
  Top Layer w0.3: v1(75.49,70.66) C54.1 ; Q3.3 80.46,69.77 v1(80.89,69.77) ; v1(33.9,71.53) R33.2 33.6,69.72 32.75,68.87 32.75,67.41 ; v1(61.51,85.72) 61.64,85.86 61.64,86.92 ; v1(45.53,87.06) 44.33,88.26 43.13,88.26 41.03,90.36 v1(41.03,91.56)
  Bottom Layer w0.3: v1(33.9,71.53) 33.9,75.43 v1(45.53,87.06) 45.83,87.36 58.13,87.36 59.63,88.86 61.94,88.86 62.54,88.26 62.54,86.76 v1(61.51,85.72) 61.51,84.22 75.01,70.72 75.43,70.72 v1(75.49,70.66) 80,70.66 v1(80.89,69.77) ; U10.C1 v1(41.03,91.56)
MCU_USB2_N: length 56.7
  Top Layer w0.3: U12.70 63.37,82.87 62.37,81.87 62.37,79.27 v1(63.02,78.62) ; v1(73.44,80.21) 68.72,75.49 v1(68.59,75.49) ; J8.A7 87.12,73.02 86.72,72.62 v1(86.72,72.32) 87.02,72.02 J8.B7 ; D1.1 D1.6 88.22,59.5 v1(87.32,59.5)
  Bottom Layer w0.3: v1(73.44,80.21) 75.82,80.21 83.72,72.32 v1(86.72,72.32) 87.62,71.42 87.62,69.07 86.24,67.69 86.24,65.91 87.32,64.83 v1(87.32,59.5) ; v1(68.59,75.49) 68.27,75.49 66.04,77.72 63.91,77.72 v1(63.02,78.62)
MCU_USB2_P: length 47.3
  Top Layer w0.3: v1(80.22,73.22) 81.42,72.02 85.62,72.02 ; D1.3 D1.4 87.72,61.9 87.72,67.52 85.62,69.62 85.62,72.02 ; U12.71 68.77,83.37 v1(69.63,82.52) ; 85.62,72.02 86.22,72.62 86.22,72.92 86.82,73.52 J8.B6 88.92,73.52 89.12,73.32 89.12,72.82 88.82,72.52 J8.A6
  Bottom Layer w0.3: v1(69.63,82.52) 69.63,81.41 77.82,73.22 v1(80.22,73.22)
PWR_CAM_EN: length 53.7
  Top Layer w0.25: 78.87,52.45 78.84,52.43 78.84,52.22 v1(78.16,51.54) 77.34,50.72 77.34,48.51 77.53,48.32 78.65,48.32 78.75,48.42 78.75,48.77
  Top Layer w0.3: R28.2 59.14,90.11 59.14,85.72 v1(59.74,85.12)
  Bottom Layer w0.3: v1(59.74,85.12) 59.91,85.12 78.96,66.08 78.96,52.34 v1(78.16,51.54)
PWR_HALT_REQ: length 41.9
  Top Layer w0.3: U12.33 v1(54.14,73.02) ; D5.A 79.27,56.82 v1(78.37,56.82)
  Bottom Layer w0.3: v1(54.14,73.02) 54.74,73.62 55.34,73.62 70.34,58.62 77.24,58.62 77.3,58.57 77.33,58.57 77.67,58.23 77.67,58.2 78.37,57.5 v1(78.37,56.82)
PWR_KILL: length 58.9
  Top Layer w0.18: v1(47.36,82.7) 47.06,83 25.76,83 v1(25.16,83.6) ; U12.53 63.49,74.37 62.96,74.9 62.96,77 60.56,79.4 v1(58.16,79.4) ; v1(20.66,88.1) 17.96,90.8 U2.7
  Top Layer w0.3: R10.2 66.34,74.37 U12.53
  Bottom Layer w0.18: v1(58.16,79.4) 52.76,84.8 49.46,84.8 v1(47.36,82.7) ; v1(20.66,88.1) v1(25.16,83.6)
RS_RST: length 61.5
  Top Layer w0.3: U7.3 35.25,65.51 35.25,69.14 v1(34.65,69.74) ; v1(65.39,82.64) 65.13,82.37 U12.69
  Bottom Layer w0.3: 46.27,88.86 33.15,75.74 33.15,71.24 v1(34.65,69.74) ; 46.27,88.86 46.57,88.56 58.57,88.56 59.47,89.46 62.17,89.46 63.97,87.66 63.97,84.06 v1(65.39,82.64) ; 46.27,88.86 U10.C2
SC_PRES_SW: length 112.4
  Top Layer w0.3: Q2.1 5.23,101.75 5.23,100.85 5.73,100.35 8.32,100.35 9.03,99.64 9.03,99.49 10.23,98.29 12.49,98.29 ; v1(65.46,92.95) 65.4,93.01 v1(63.88,93.01) ; D4.C SC_SW.1 79.78,73.81 v1(83.08,73.81) ; v1(52.53,98.59) 49.39,95.45 16.97,95.45 14.13,98.29 12.49,98.29 ; Q5.1 11.89,94.39 11.89,97.09 ; 11.89,97.09 11.89,97.69 12.49,98.29 ; 11.89,97.09 9.52,97.09 R27.1
  Bottom Layer w0.3: v1(63.88,93.01) 59.62,93.01 U10.C9 52.83,98.89 v1(52.53,98.59) ; v1(83.08,73.81) 83.08,75.33 78.4,80.02 76.87,80.02 73.53,83.35 73.53,83.83 73.87,84.17 73.87,84.54 v1(65.46,92.95)
SC_UART_CLK: length 71.7
  Top Layer w0.3: v1(30.81,66.96) 30.81,66.85 32.75,64.91 ; U12.65 66.43,80.37 v1(66.51,80.29)
  Bottom Layer w0.3: v1(66.51,80.29) 66.51,84.96 66.81,85.26 66.81,85.86 62.61,90.06 59.31,90.06 58.71,89.46 55.11,89.46 54.51,90.06 54.51,90.66 53.31,91.86 51.51,91.86 50.91,91.26 46.41,91.26 U10.C3 44.01,93.66 41.91,93.66 41.61,93.36 41.61,91.26 32.91,82.56 32.91,78.66 30.81,76.56 v1(30.81,66.96)
SC_UART_TX: length 106.2
  Top Layer w0.3: U7.4 34.06,68 v1(33.81,68) 33.81,68.71 R33.1 ; U12.63 65.39,79.37 65.69,79.67 67.15,79.67 v1(67.32,79.85) ; v1(44.61,89.6) 56.18,101.16 v1(63.51,101.16)
  Bottom Layer w0.3: U10.C7 45.21,114.78 58.83,101.16 v1(63.51,101.16) 64.89,99.79 64.89,88.39 67.24,86.04 67.24,79.93 v1(67.32,79.85) ; v1(33.81,68) 33.81,68.3 32.61,69.5 32.61,76.1 44.61,88.1 v1(44.61,89.6)
SCR_BL_PWM: length 46.7
  Top Layer w0.3: T1.1 79.9,39.37 R14.2 79.64,41 v1(79.64,41.52) ; v1(54.44,62.82) v1(73.64,43.62) ; U12.30 52.64,70.02 v1(53.24,69.42)
  Bottom Layer w0.3: v1(79.64,41.52) 77.54,43.62 v1(73.64,43.62) ; v1(53.24,69.42) 54.44,68.22 v1(54.44,62.82)
SCR_D/C: length 21.4
  Top Layer w0.3: v1(34.58,74.07) 32.64,76.02 J2.6 ; U12.23 48.05,74.37 46.25,72.57 39.68,72.57 v1(36.68,75.57)
  Bottom Layer w0.3: v1(36.68,75.57) 35.18,74.07 v1(34.58,74.07)
SCR_RST: length 17.9
  Top Layer w0.3: U12.24 49.04,73.82 48.14,73.82 46.44,72.12 39.14,72.12 34.64,76.62 J2.2
SCR_SPI_MOSI: length 28.6
  Top Layer w0.3: v1(52.74,68.22) 52.14,67.62 52.14,67.32 51.84,67.02 48.54,67.02 44.04,71.52 38.94,71.52 34.14,76.32 J2.3 ; v1(53.34,70.62) 53.64,70.93 U12.32
  Bottom Layer w0.3: v1(52.74,68.22) 52.44,68.52 52.44,69.72 v1(53.34,70.62)
SCR_SPI_SCK: length 36.8
  Top Layer w0.3: v1(35.74,73.62) 35.74,73.92 33.64,76.02 J2.4 ; 60.64,86.92 60.64,87.92 60.44,88.12 v1(59.84,88.12)
  Bottom Layer w0.3: v1(59.84,88.12) 58.54,86.82 49.24,86.82 48.04,85.62 47.74,85.62 v1(35.74,73.62)
SYS_PG: length 12.7
  Top Layer w0.18: v1(17.83,84.9) 15.66,87.07 U2.4
  Top Layer w0.3: v1(17.83,84.9) R9.2 ; IC2.1 v1(18.43,80.03)
  Bottom Layer w0.3: v1(18.43,80.03) 18.43,84.23 17.83,84.83 v1(17.83,84.9)
USB_5V: length 86.8
  Top Layer w0.3: v1(67.84,62.77) 66.64,63.97 44.74,63.97 v1(42.64,66.07) ; F1.1 78.49,60.37 v1(77.84,59.72)
  Top Layer w0.5: J8.B4_A9 89.17,75.17 89.72,74.62 89.72,70.16 89.56,70
  Top Layer w0.6: J8.A4_B9 87.93,70.36 89.26,70.36 89.56,70.06 89.56,69.79 v1(89.12,69.35)
  Top Layer w0.9: F1.1 82.24,62.17 v1(86.92,66.85)
  VCC (3) w0.5: v1(86.92,66.85) 86.92,67.36 88.91,69.35 v1(89.12,69.35)
  Bottom Layer w0.3: v1(77.84,59.72) 74.78,62.77 v1(67.84,62.77) ; VIN.1 29.01,52.44 v1(42.64,66.07)
  vias: v2(86.55,75.16) v2(86.59,70.36)
VSYS: length 78.2
  Top Layer w0.25: U1.13 U1.14 14.92,48.56 14.92,49.76 15.07,49.91 C5.1
  Top Layer w0.3: 8.2,97.21 7.49,97.21 C9.1 ; 8.2,97.21 8.2,99.24 8.32,99.35 ; 8.2,97.21 R27.2 8.5,94.19 11.23,91.47 13.93,91.47 R26.2 14.66,91.77 15.07,91.35 v1(15.07,90.96) 15.42,91.3 U2.1 ; 15.97,53.06 15.56,52.64 15.56,51.47 ; 15.56,51.47 C6.1 ; 15.56,51.47 15.37,51.28 15.37,50.26 C5.1 ; v1(16.27,53.16) 15.97,52.86
  Top Layer w0.5: 15.97,52.86 15.97,53.09 R5.1
  VCC (3) w0.3: v2(26.8,54.36) 26.43,53.99
  VCC (3) w0.9: v1(16.27,53.16) 23.81,53.16 24.49,53.84 26.43,53.84 26.35,53.92 26.35,65.38 14.1,77.62 14.1,90.04 15.01,90.96 v1(15.07,90.96)
  Bottom Layer w0.3: VSYS.1 27.31,54.06 27.18,53.93 27.18,53.98 v2(26.8,54.36)
